# Altium schematic sheet Sheet1.SchDoc (part 1 of 2)
size A0
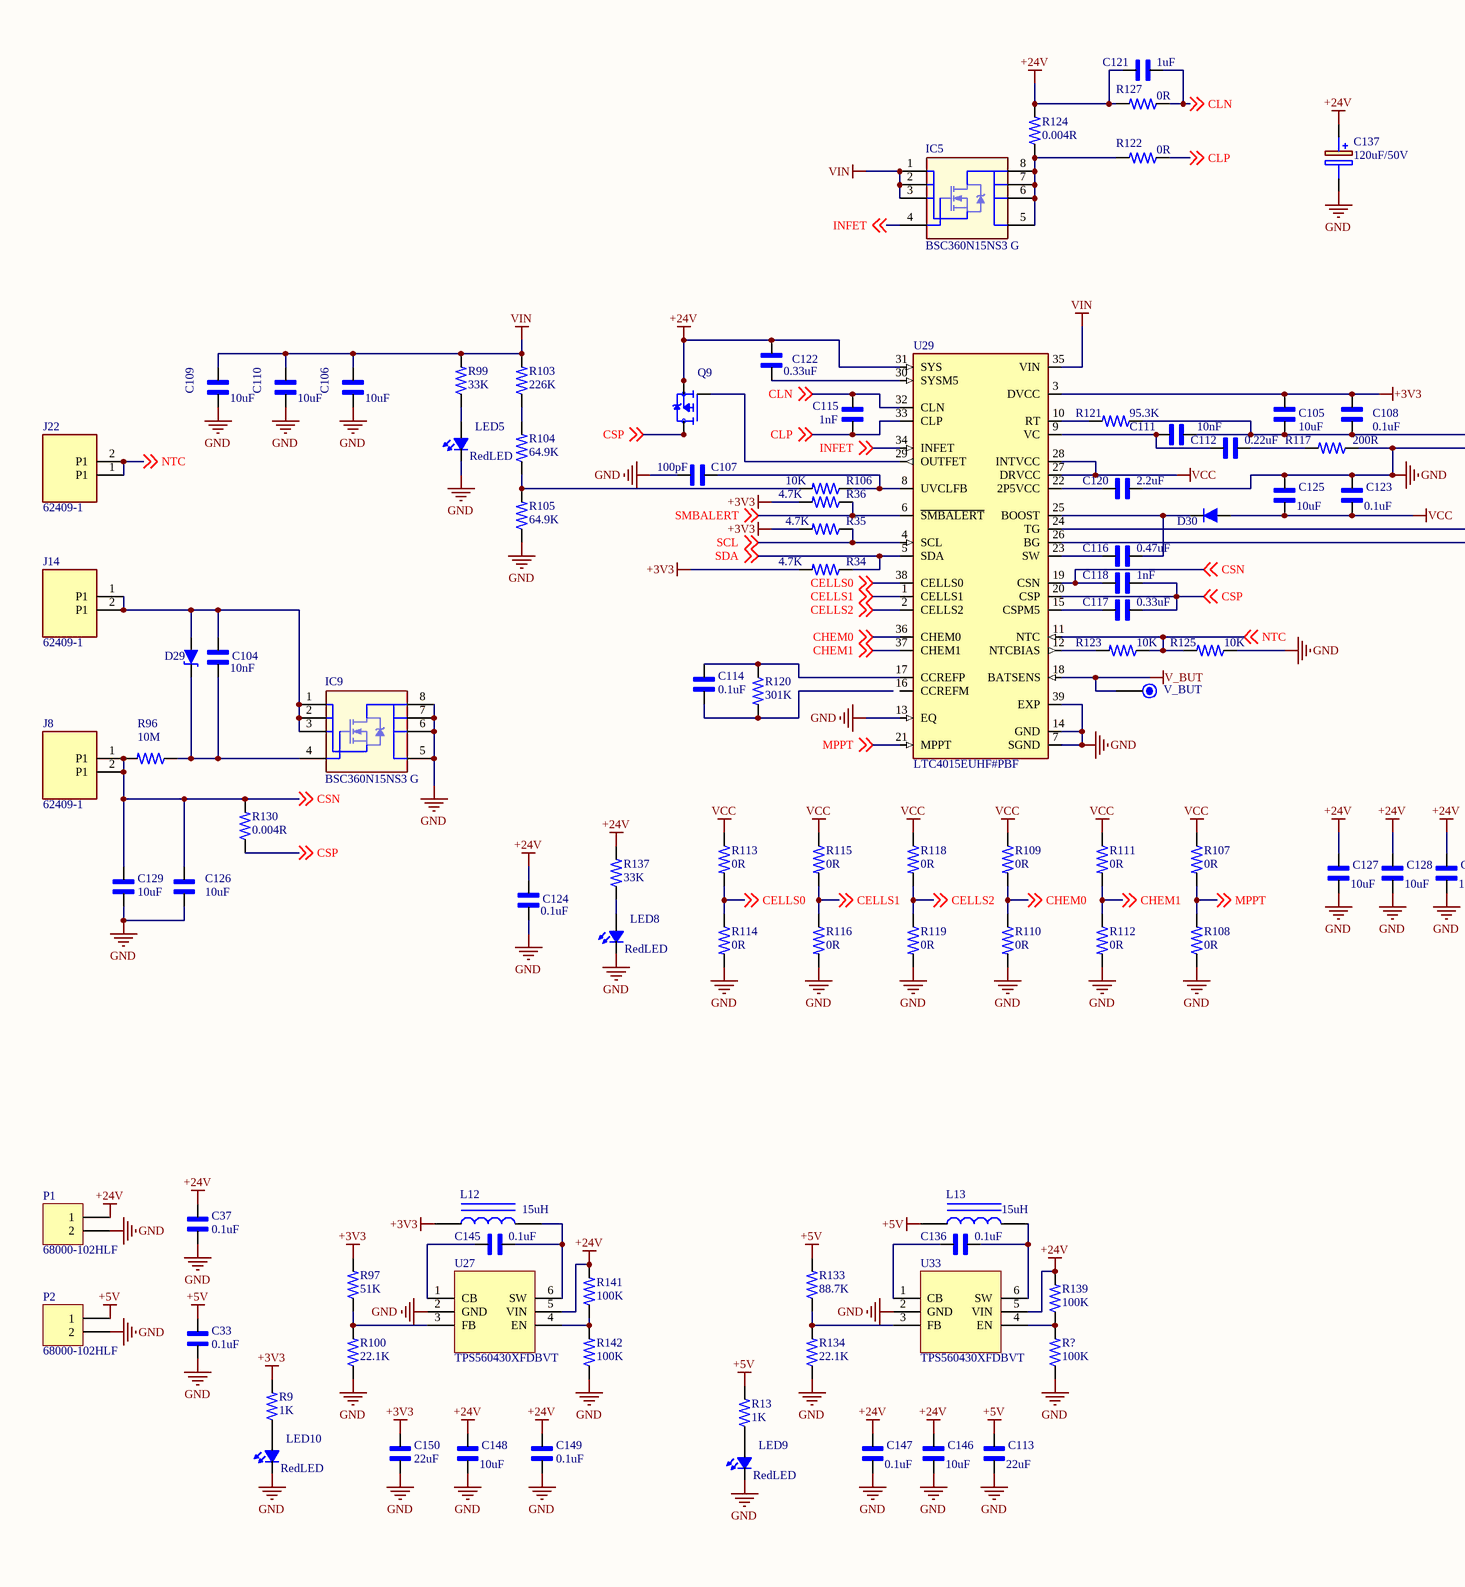
[diagram p0: Sheet1.SchDoc, top left]
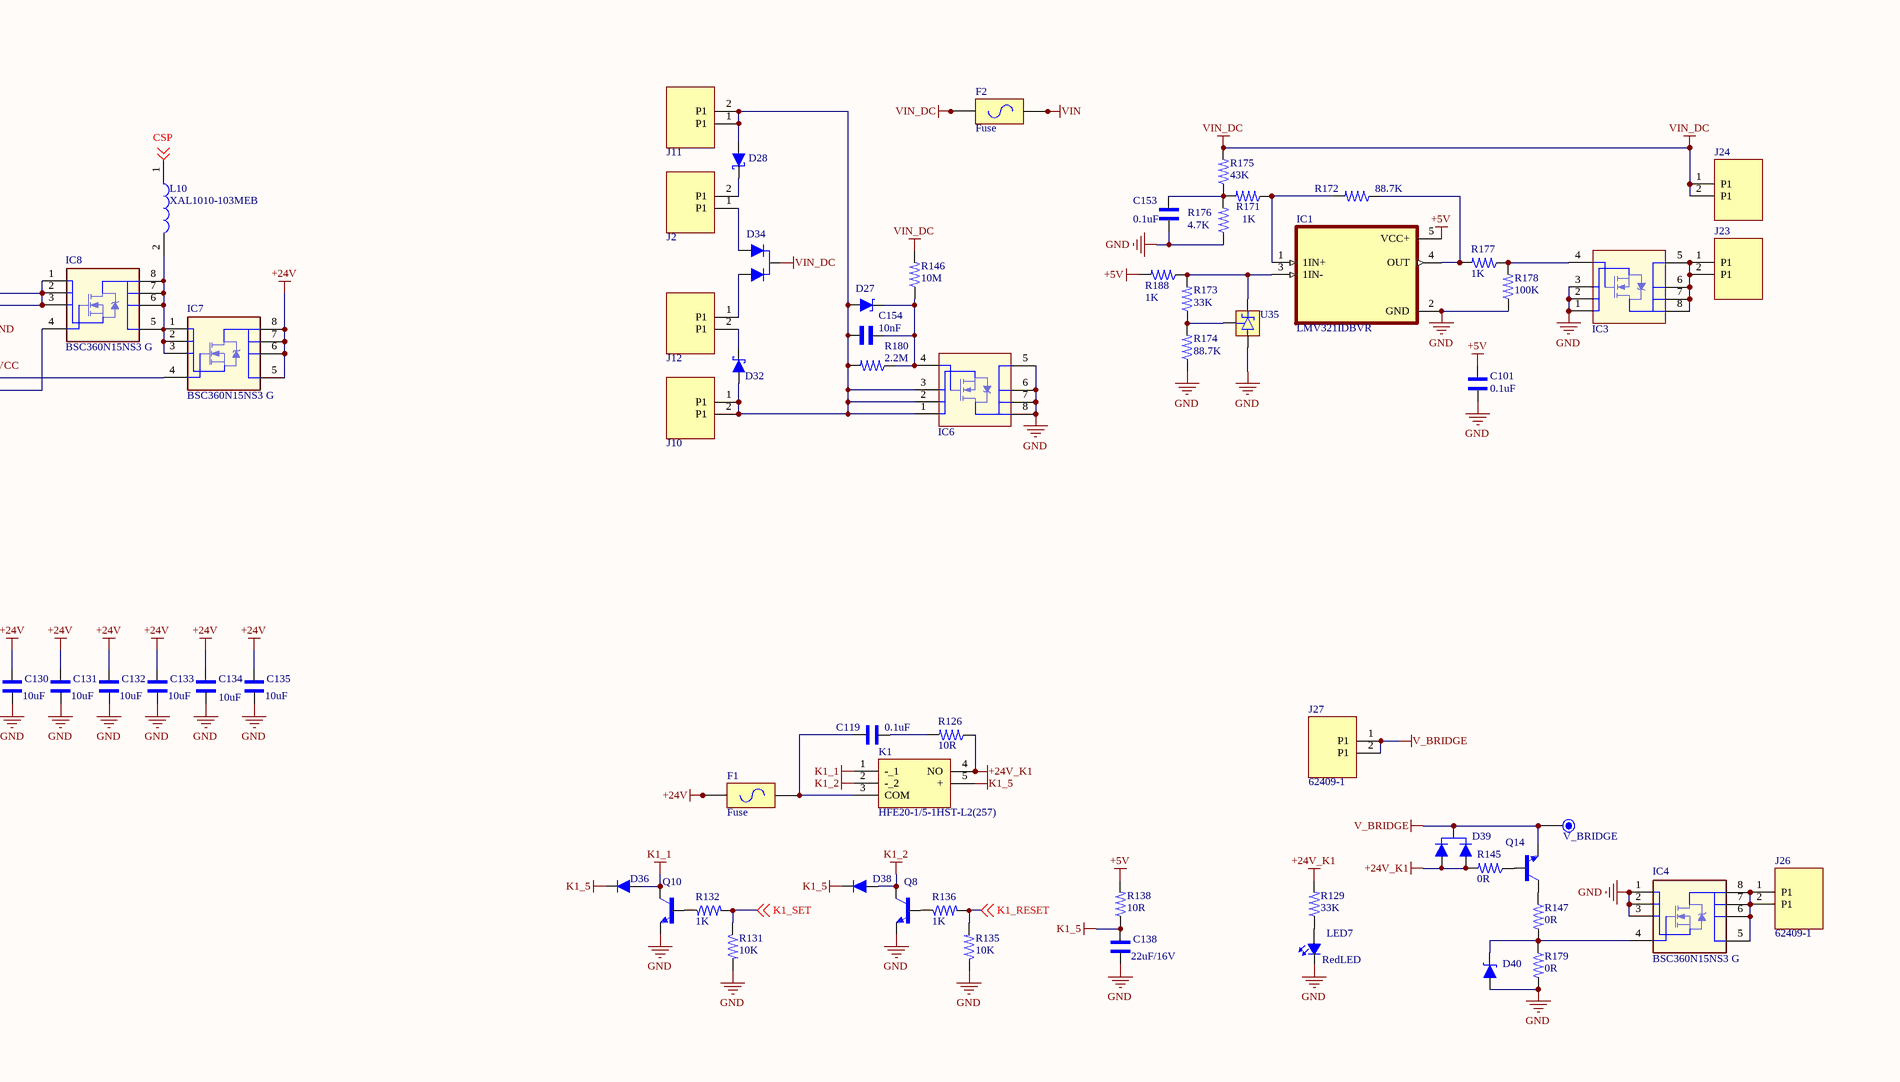
[diagram p1: Sheet1.SchDoc, top middle]
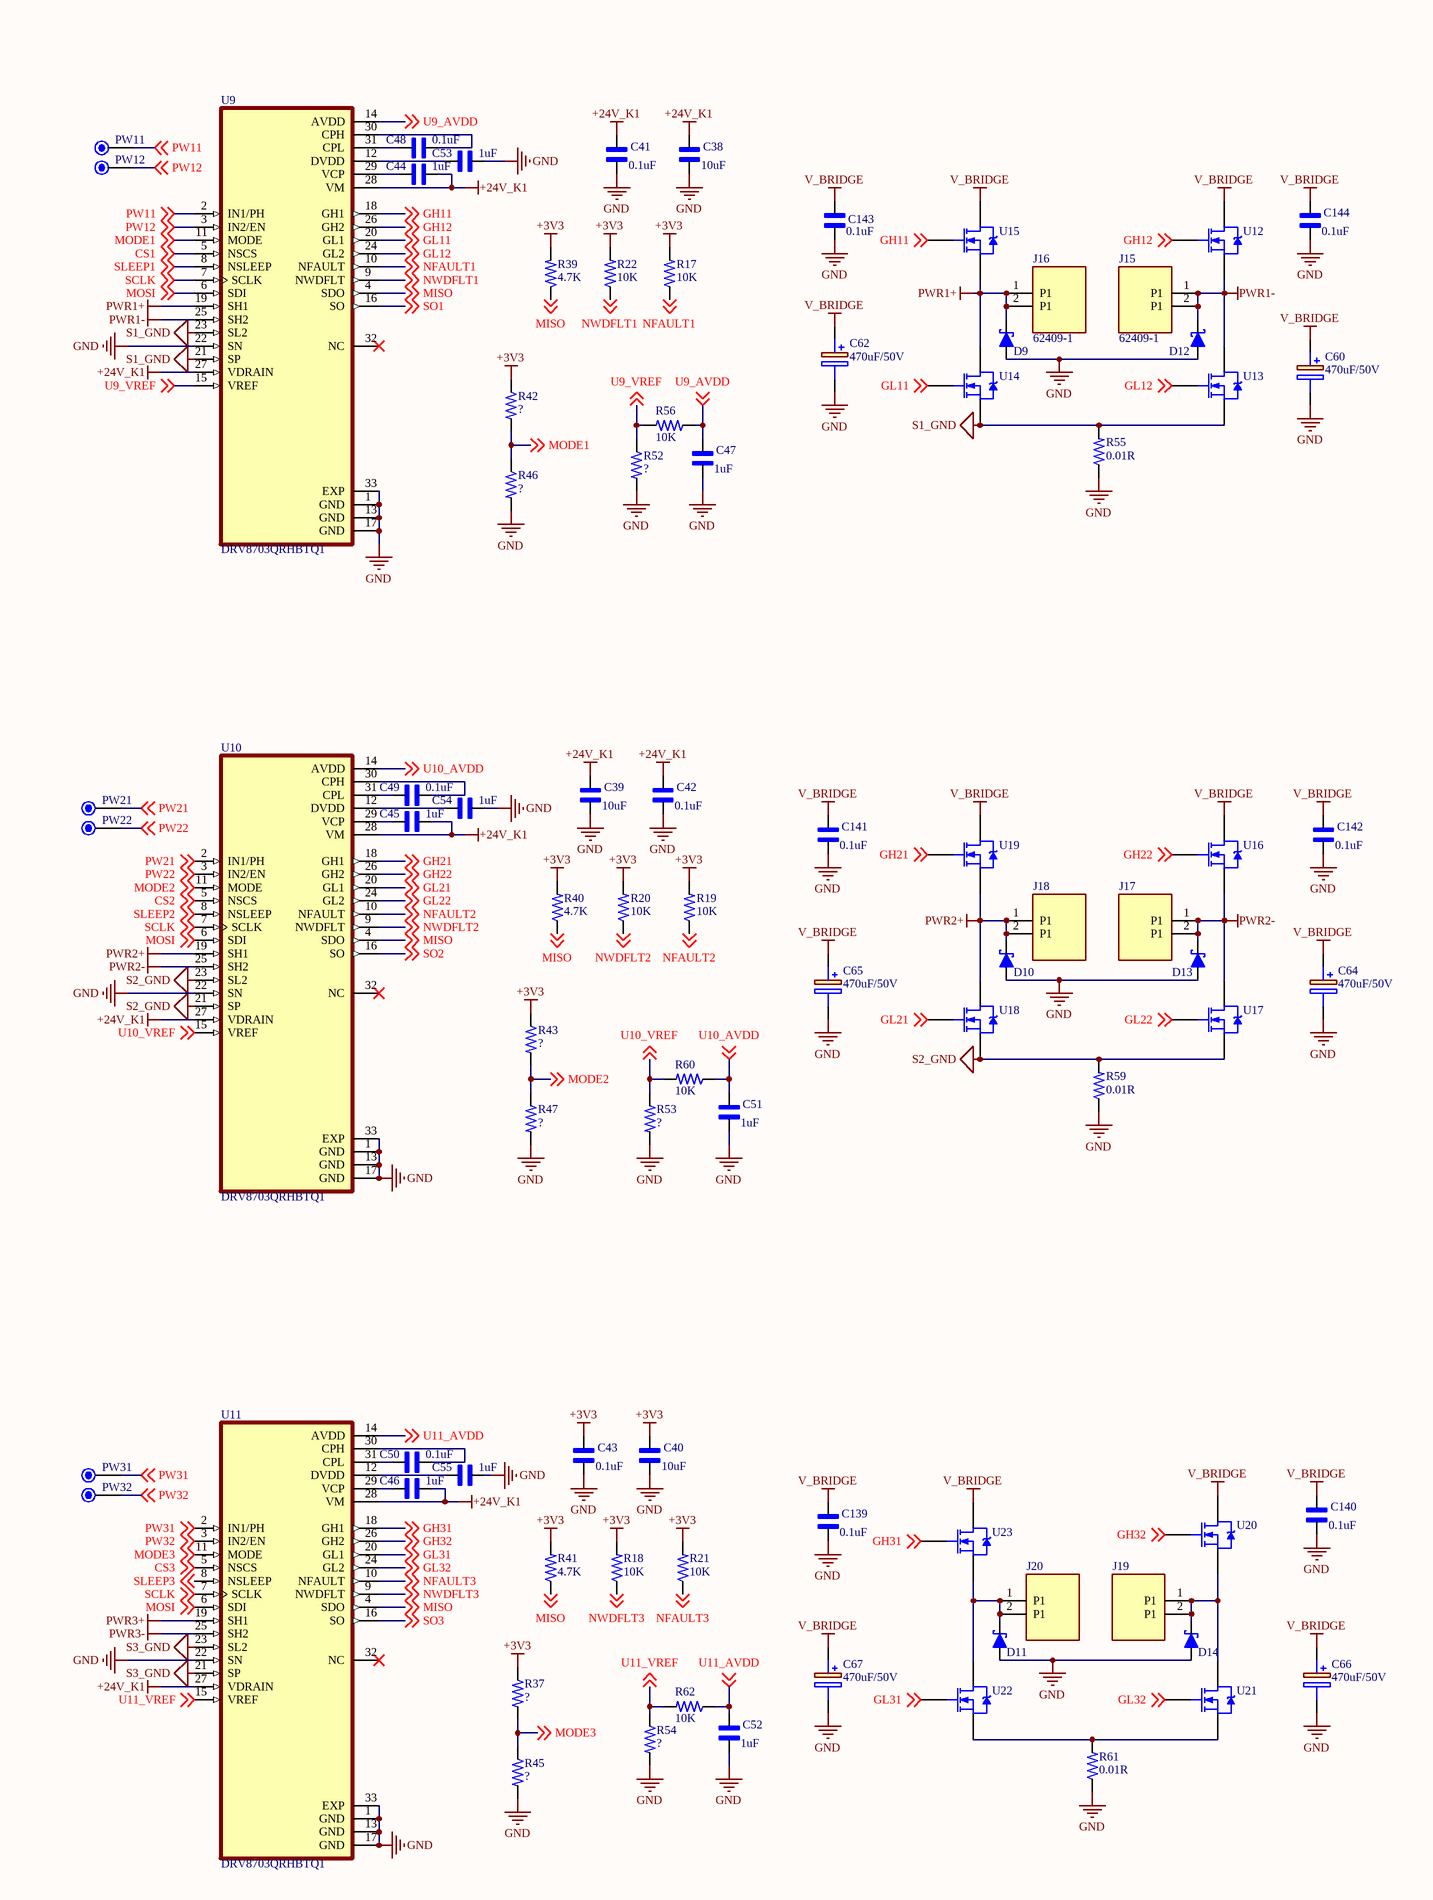
[diagram p2: Sheet1.SchDoc, top right]
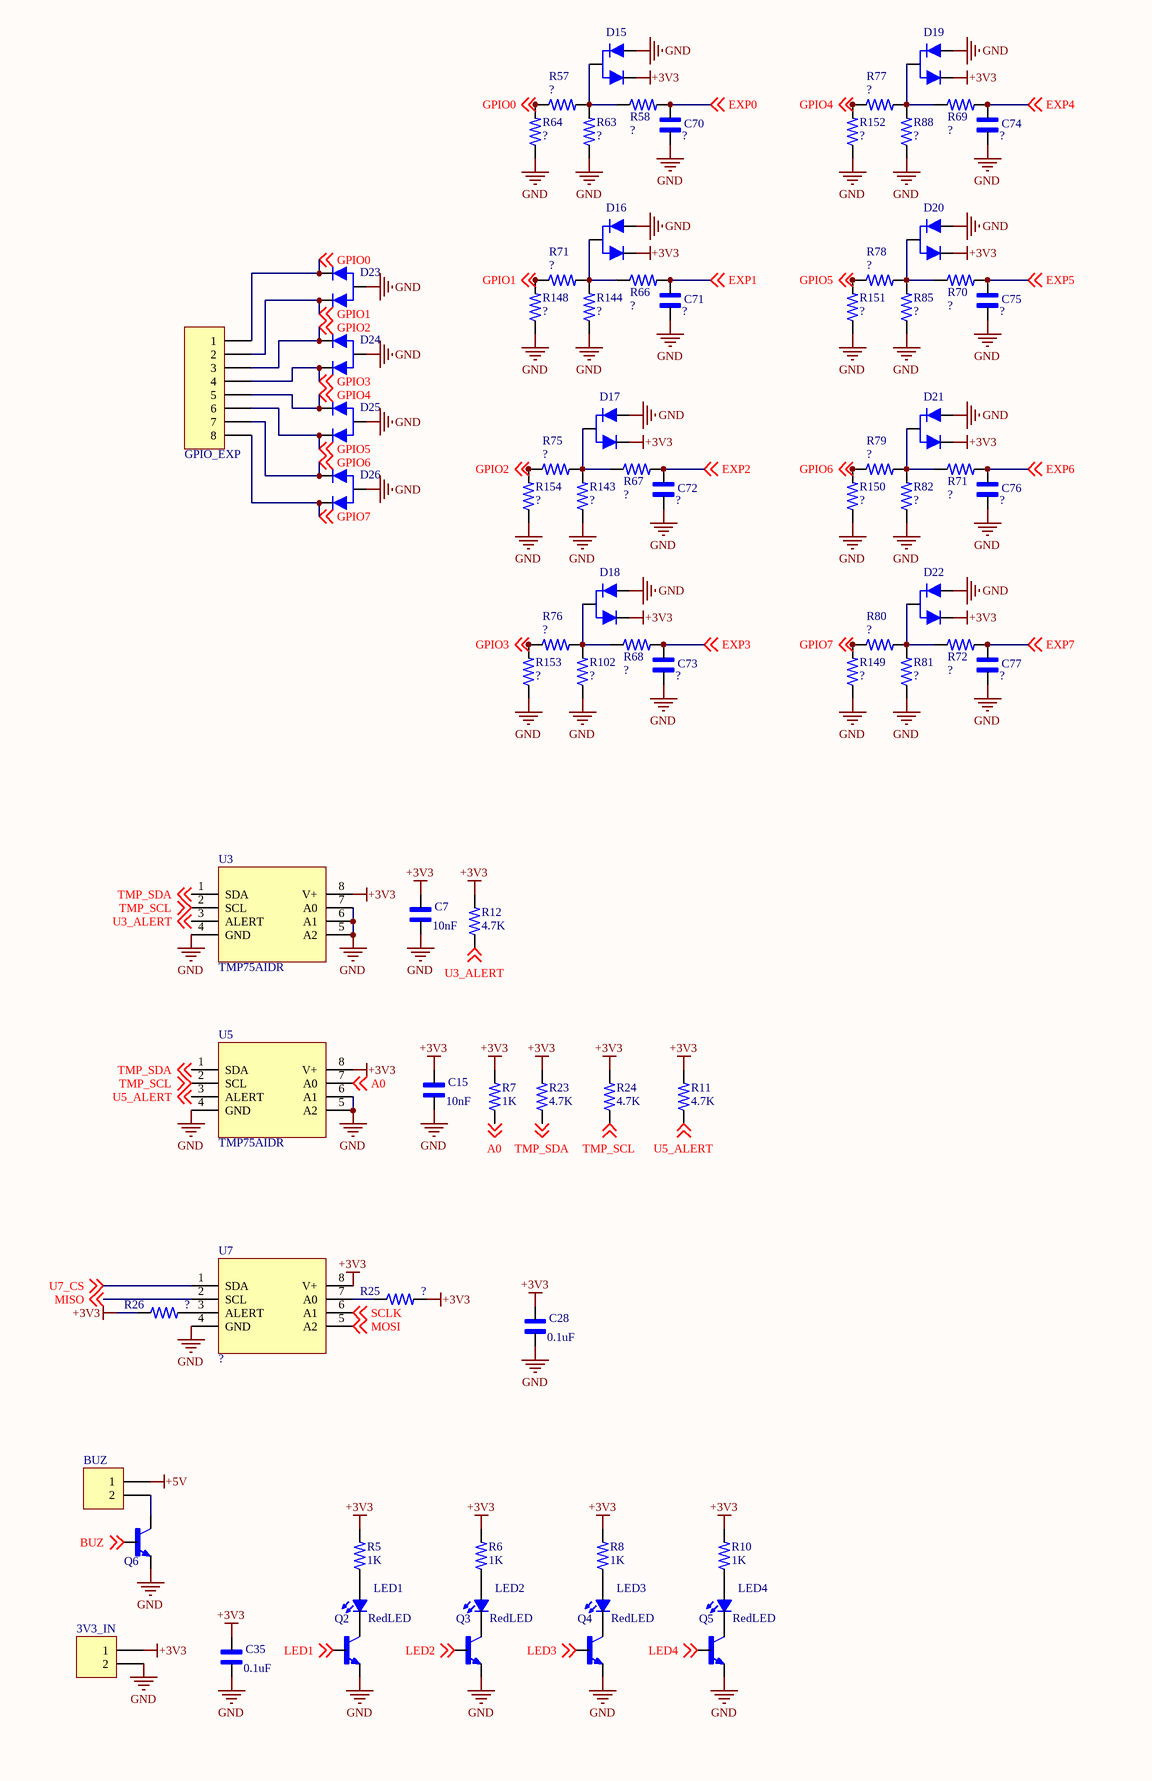
[diagram p3: Sheet1.SchDoc, bottom left]
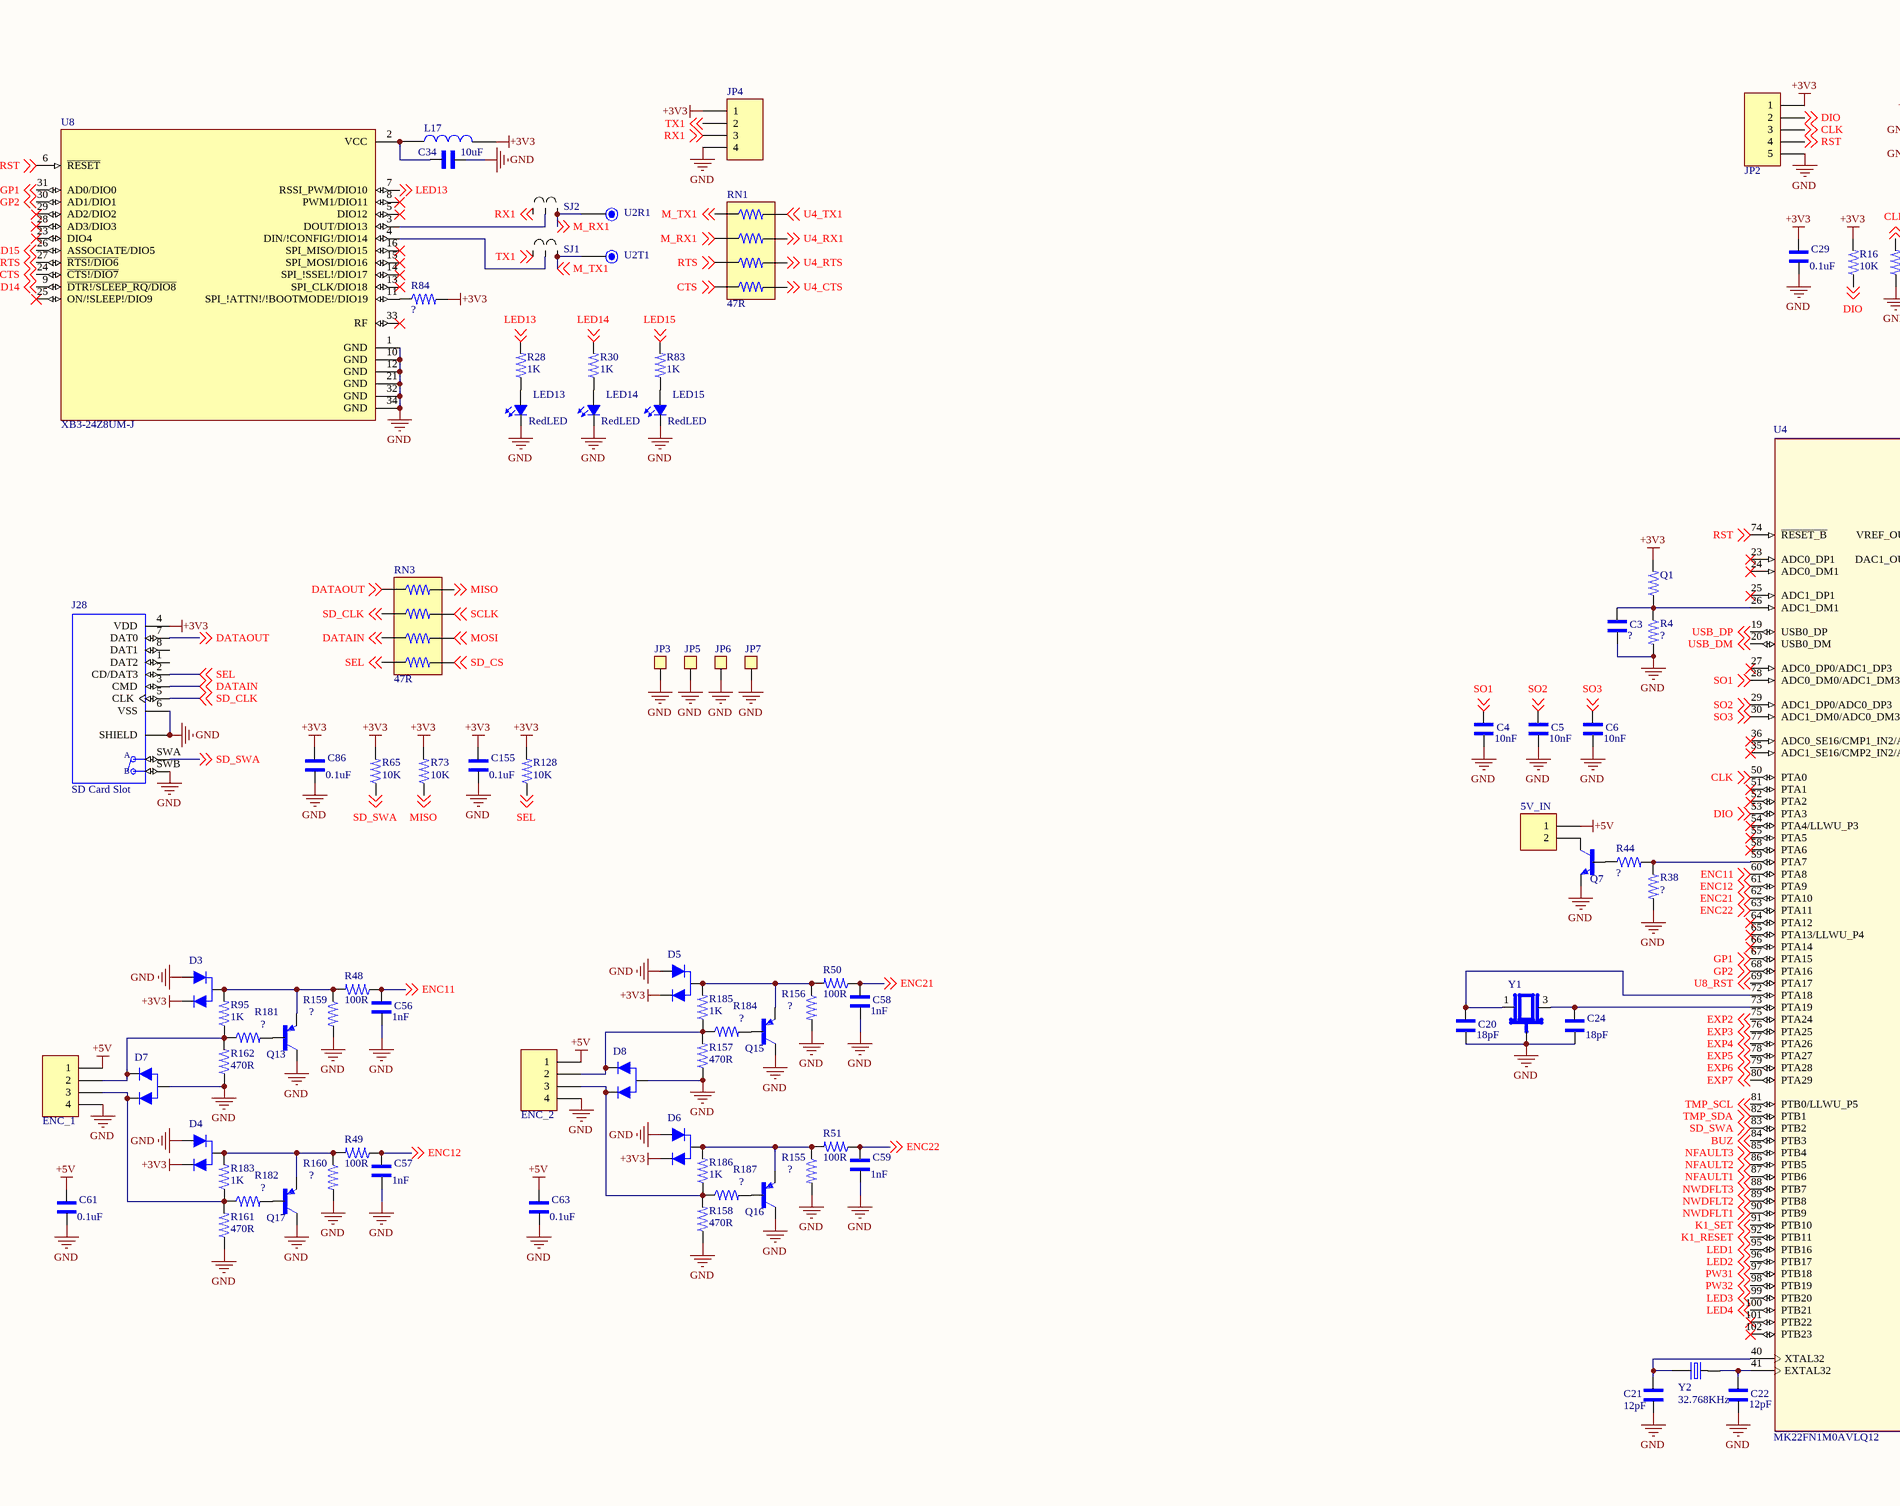
[diagram p4: Sheet1.SchDoc, bottom middle]
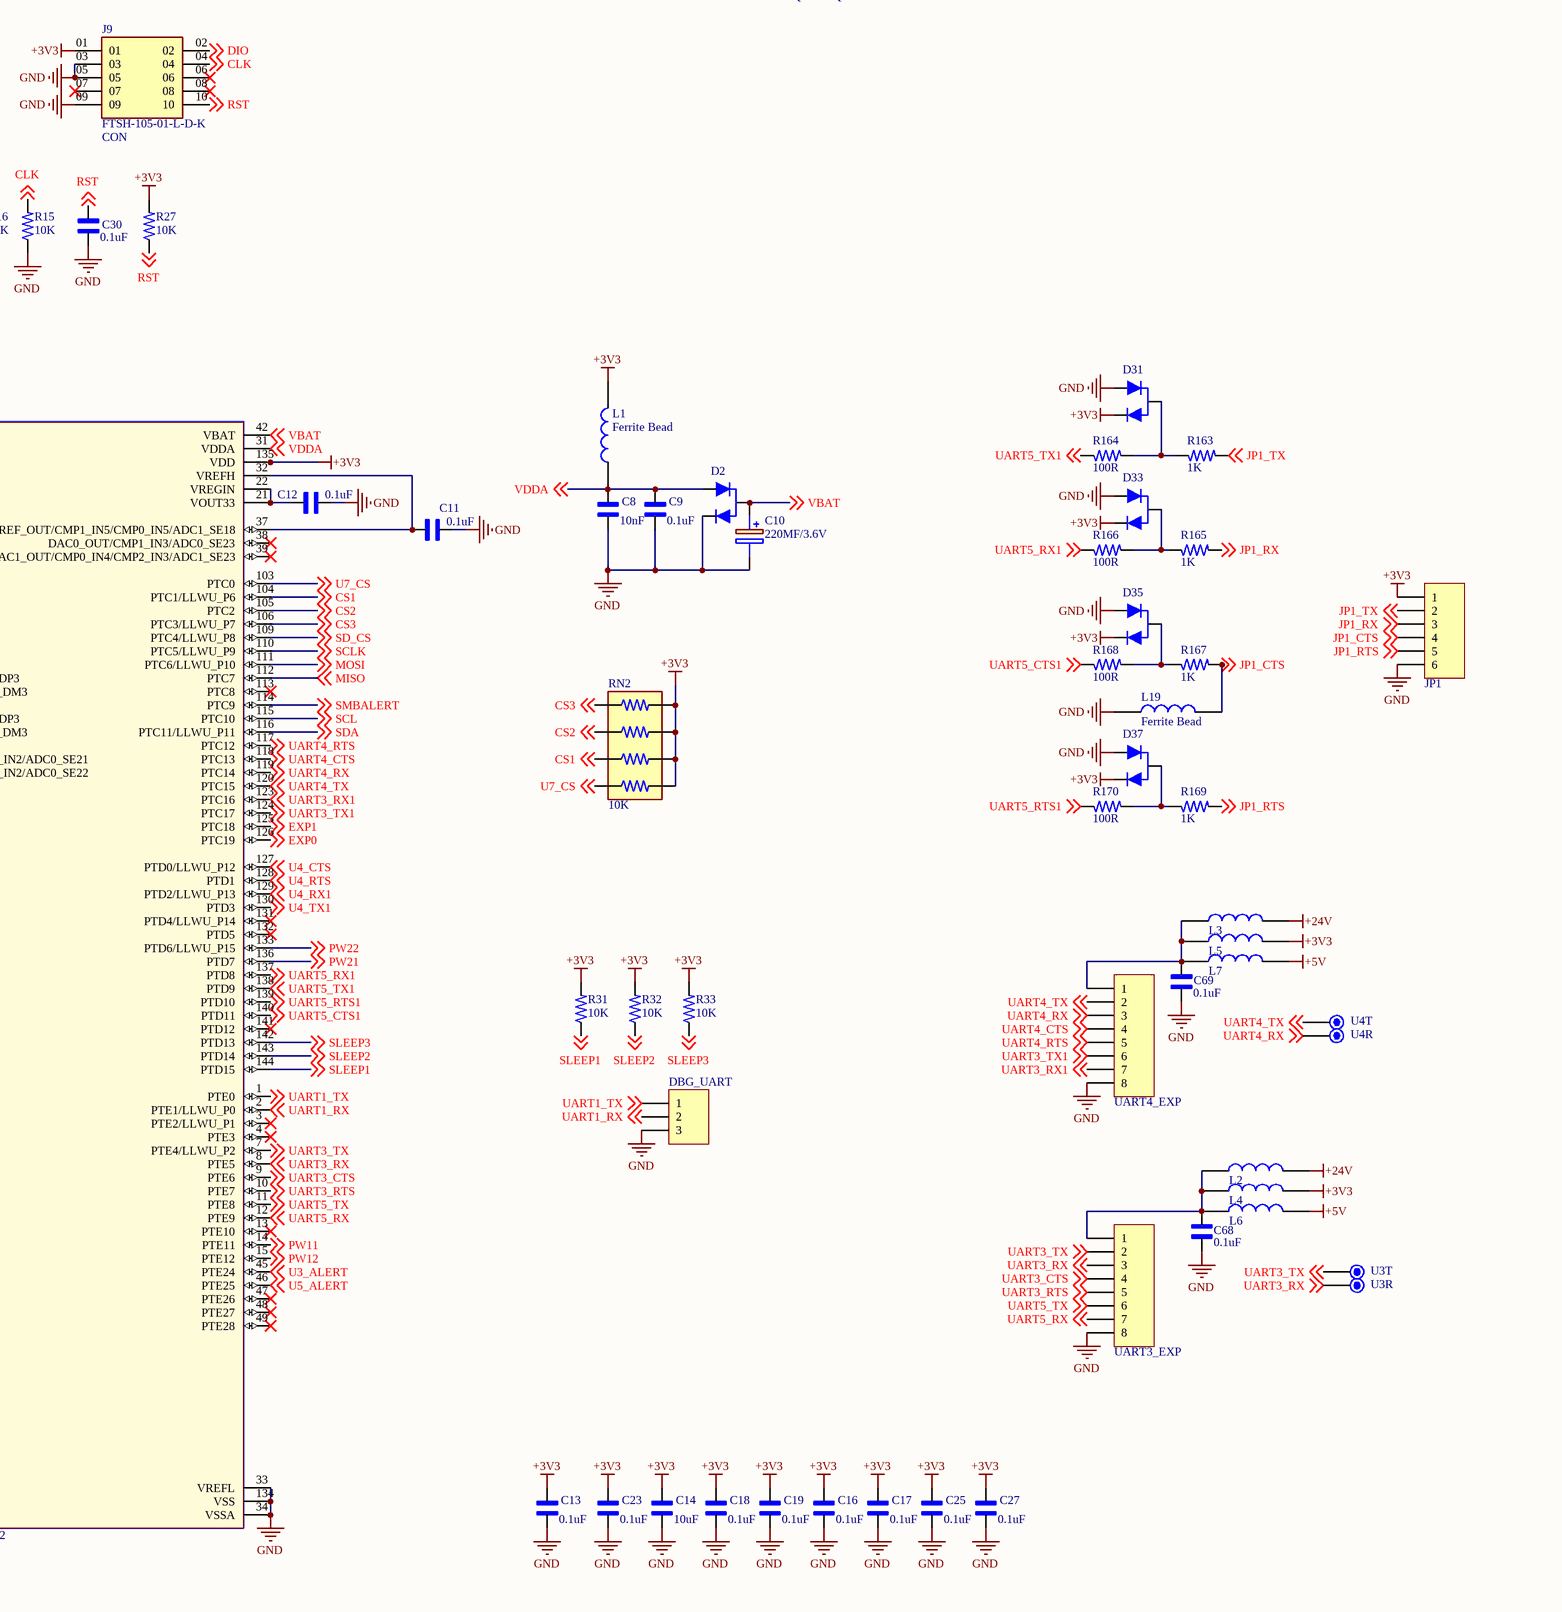
[diagram p5: Sheet1.SchDoc, bottom right]

## Parts
(Parts that share a designator on the sheet are numbered #1, #2 ... from top to bottom, then left to right.)
3V3_IN  68000-102HLF  [HDR1X2(male)]  (value not drawn)
5V_IN  68000-102HLF  [HDR1X2(male)]  (value not drawn)
BUZ  68000-102HLF  [HDR1X2(male)]  (value not drawn)
C3  C?  [CAPC_0805 (2012X140N)]  (value not drawn)
C4  value 10nF  [CAPC_0805 (2012X140N)]  (hidden comment: 08055C103KAT2A)
C5  value 10nF  [CAPC_0805 (2012X140N)]  (hidden comment: 08055C103KAT2A)
C6  value 10nF  [CAPC_0805 (2012X140N)]  (hidden comment: 08055C103KAT2A)
C7  value 10nF  [CAPC_0805 (2012X140N)]  (hidden comment: 08055C103KAT2A)
C8  value 10nF  [CAPC_0805 (2012X140N)]  (hidden comment: 08055C103KAT2A)
C9  value 0.1uF  [CAPC_0805 (2012X140N)]  (hidden comment: 0805B104K500CT)
C10  value 220MF/3.6V  [EEC-RG0V224H]  (hidden comment: EEC-RG0V224H)
C11  value 0.1uF  [CAPC_0805 (2012X140N)]  (hidden comment: 0805B104K500CT)
C12  value 0.1uF  [CAPC_0805 (2012X140N)]  (hidden comment: 0805B104K500CT)
C13  value 0.1uF  [CAPC_0805 (2012X140N)]  (hidden comment: 0805B104K500CT)
C14  value 10uF  [CAPC_0805 (2012X140N)]  (hidden comment: GRM21BR61E106KA73L)
C15  value 10nF  [CAPC_0805 (2012X140N)]  (hidden comment: 08055C103KAT2A)
C16  value 0.1uF  [CAPC_0805 (2012X140N)]  (hidden comment: 0805B104K500CT)
C17  value 0.1uF  [CAPC_0805 (2012X140N)]  (hidden comment: 0805B104K500CT)
C18  value 0.1uF  [CAPC_0805 (2012X140N)]  (hidden comment: 0805B104K500CT)
C19  value 0.1uF  [CAPC_0805 (2012X140N)]  (hidden comment: 0805B104K500CT)
C20  value 18pF  [CAPC_0805 (2012X140N)]  (hidden comment: 0805N180J500CT)
C21  value 12pF  [CAPC_0805 (2012X140N)]  (hidden comment: 0805N120J500CT)
C22  value 12pF  [CAPC_0805 (2012X140N)]  (hidden comment: 0805N120J500CT)
C23  value 0.1uF  [CAPC_0805 (2012X140N)]  (hidden comment: 0805B104K500CT)
C24  value 18pF  [CAPC_0805 (2012X140N)]  (hidden comment: 0805N180J500CT)
C25  value 0.1uF  [CAPC_0805 (2012X140N)]  (hidden comment: 0805B104K500CT)
C27  value 0.1uF  [CAPC_0805 (2012X140N)]  (hidden comment: 0805B104K500CT)
C28  value 0.1uF  [CAPC_0805 (2012X140N)]  (hidden comment: 0805B104K500CT)
C29  value 0.1uF  [CAPC_0805 (2012X140N)]  (hidden comment: 0805B104K500CT)
C30  value 0.1uF  [CAPC_0805 (2012X140N)]  (hidden comment: 0805B104K500CT)
C33  value 0.1uF  [CAPC_0805 (2012X140N)]  (hidden comment: 0805B104K500CT)
C34  value 10uF  [CAPC_0805 (2012X140N)]  (hidden comment: GRM21BR61E106KA73L)
C35  value 0.1uF  [CAPC_0805 (2012X140N)]  (hidden comment: 0805B104K500CT)
C37  value 0.1uF  [CAPC_0805 (2012X140N)]  (hidden comment: 0805B104K500CT)
C38  value 10uF  [CAPC_1210 (3225X280)]  (hidden comment: GRM32ER71H106KA12L)
C39  value 10uF  [CAPC_1210 (3225X280)]  (hidden comment: GRM32ER71H106KA12L)
C40  value 10uF  [CAPC_1210 (3225X280)]  (hidden comment: GRM32ER71H106KA12L)
C41  value 0.1uF  [CAPC_0805 (2012X140N)]  (hidden comment: 0805B104K500CT)
C42  value 0.1uF  [CAPC_0805 (2012X140N)]  (hidden comment: 0805B104K500CT)
C43  value 0.1uF  [CAPC_0805 (2012X140N)]  (hidden comment: 0805B104K500CT)
C44  value 1uF  [CAPC_0805 (2012X140N)]  (hidden comment: 08055C105KAT2A)
C45  value 1uF  [CAPC_0805 (2012X140N)]  (hidden comment: 08055C105KAT2A)
C46  value 1uF  [CAPC_0805 (2012X140N)]  (hidden comment: 08055C105KAT2A)
C47  value 1uF  [CAPC_0805 (2012X140N)]  (hidden comment: 08055C105KAT2A)
C48  value 0.1uF  [CAPC_0805 (2012X140N)]  (hidden comment: 0805B104K500CT)
C49  value 0.1uF  [CAPC_0805 (2012X140N)]  (hidden comment: 0805B104K500CT)
C50  value 0.1uF  [CAPC_0805 (2012X140N)]  (hidden comment: 0805B104K500CT)
C51  value 1uF  [CAPC_0805 (2012X140N)]  (hidden comment: 08055C105KAT2A)
C52  value 1uF  [CAPC_0805 (2012X140N)]  (hidden comment: 08055C105KAT2A)
C53  value 1uF  [CAPC_0805 (2012X140N)]  (hidden comment: 08055C105KAT2A)
C54  value 1uF  [CAPC_0805 (2012X140N)]  (hidden comment: 08055C105KAT2A)
C55  value 1uF  [CAPC_0805 (2012X140N)]  (hidden comment: 08055C105KAT2A)
C56  value 1nF  [CAPC_0805 (2012X140N)]  (hidden comment: 08055C102KAT4A)
C57  value 1nF  [CAPC_0805 (2012X140N)]  (hidden comment: 08055C102KAT4A)
C58  value 1nF  [CAPC_0805 (2012X140N)]  (hidden comment: 08055C102KAT4A)
C59  value 1nF  [CAPC_0805 (2012X140N)]  (hidden comment: 08055C102KAT4A)
C60  value 470uF/50V  [CAPPRD(5x10)]  (hidden comment: ESH477M050AH4AA)
C61  value 0.1uF  [CAPC_0805 (2012X140N)]  (hidden comment: 0805B104K500CT)
C62  value 470uF/50V  [CAPPRD(5x10)]  (hidden comment: ESH477M050AH4AA)
C63  value 0.1uF  [CAPC_0805 (2012X140N)]  (hidden comment: 0805B104K500CT)
C64  value 470uF/50V  [CAPPRD(5x10)]  (hidden comment: ESH477M050AH4AA)
C65  value 470uF/50V  [CAPPRD(5x10)]  (hidden comment: ESH477M050AH4AA)
C66  value 470uF/50V  [CAPPRD(5x10)]  (hidden comment: ESH477M050AH4AA)
C67  value 470uF/50V  [CAPPRD(5x10)]  (hidden comment: ESH477M050AH4AA)
C68  value 0.1uF  [CAPC_0805 (2012X140N)]  (hidden comment: 0805B104K500CT)
C69  value 0.1uF  [CAPC_0805 (2012X140N)]  (hidden comment: 0805B104K500CT)
C70  C?  [CAPC_0805 (2012X140N)]  (value not drawn)
C71  C?  [CAPC_0805 (2012X140N)]  (value not drawn)
C72  C?  [CAPC_0805 (2012X140N)]  (value not drawn)
C73  C?  [CAPC_0805 (2012X140N)]  (value not drawn)
C74  C?  [CAPC_0805 (2012X140N)]  (value not drawn)
C75  C?  [CAPC_0805 (2012X140N)]  (value not drawn)
C76  C?  [CAPC_0805 (2012X140N)]  (value not drawn)
C77  C?  [CAPC_0805 (2012X140N)]  (value not drawn)
C86  value 0.1uF  [CAPC_0805 (2012X140N)]  (hidden comment: 0805B104K500CT)
C101  value 0.1uF  [CAPC_0805 (2012X140N)]  (hidden comment: 0805B104K500CT)
C104  value 10nF  [CAPC_0805 (2012X140N)]  (hidden comment: 08055C103KAT2A)
C105  value 10uF  [CAPC_0805 (2012X140N)]  (hidden comment: GRM21BR61E106KA73L)
C106  value 10uF  [CAPC_1210 (3225X280)]  (hidden comment: GRM32ER71H106KA12L)
C107  value 100pF  [CAPC_0805 (2012X140N)]  (hidden comment: VJ0805A101JXAAC)
C108  value 0.1uF  [CAPC_0805 (2012X140N)]  (hidden comment: 0805B104K500CT)
C109  value 10uF  [CAPC_1210 (3225X280)]  (hidden comment: GRM32ER71H106KA12L)
C110  value 10uF  [CAPC_1210 (3225X280)]  (hidden comment: GRM32ER71H106KA12L)
C111  value 10nF  [CAPC_0805 (2012X140N)]  (hidden comment: 08055C103KAT2A)
C112  value 0.22uF  [CAPC_0805 (2012X140N)]  (hidden comment: UMK212B7224KG-T)
C113  value 22uF  [CAPC_0805 (2012X140N)]  (hidden comment: GRM21BR60J226ME39L)
C114  value 0.1uF  [CAPC_0805 (2012X140N)]  (hidden comment: 0805B104K500CT)
C115  value 1nF  [CAPC_0805 (2012X140N)]  (hidden comment: 08055C102KAT4A)
C116  value 0.47uF  [CAPC_0805 (2012X140N)]  (hidden comment: CC0805ZRY5V9BB474)
C117  value 0.33uF  [CAPC_0805 (2012X140N)]  (hidden comment: VJ0805V334MXACW1BC)
C118  value 1nF  [CAPC_0805 (2012X140N)]  (hidden comment: 08055C102KAT4A)
C119  value 0.1uF  [CAP_1206 (C3216X88N)]  (hidden comment: C1206C104M5RACTU)
C120  value 2.2uF  [CAPC_0805 (2012X140N)]  (hidden comment: UMK212BB7225KG-T)
C121  value 1uF  [CAPC_0805 (2012X140N)]  (hidden comment: 08055C105KAT2A)
C122  value 0.33uF  [CAPC_0805 (2012X140N)]  (hidden comment: VJ0805V334MXACW1BC)
C123  value 0.1uF  [CAPC_0805 (2012X140N)]  (hidden comment: 0805B104K500CT)
C124  value 0.1uF  [CAPC_0805 (2012X140N)]  (hidden comment: 0805B104K500CT)
C125  value 10uF  [CAPC_0805 (2012X140N)]  (hidden comment: GRM21BR61E106KA73L)
C126  value 10uF  [CAPC_1210 (3225X280)]  (hidden comment: GRM32ER71H106KA12L)
C127  value 10uF  [CAPC_1210 (3225X280)]  (hidden comment: GRM32ER71H106KA12L)
C128  value 10uF  [CAPC_1210 (3225X280)]  (hidden comment: GRM32ER71H106KA12L)
C129  value 10uF  [CAPC_1210 (3225X280)]  (hidden comment: GRM32ER71H106KA12L)
C130  value 10uF  [CAPC_1210 (3225X280)]  (hidden comment: GRM32ER71H106KA12L)
C131  value 10uF  [CAPC_1210 (3225X280)]  (hidden comment: GRM32ER71H106KA12L)
C132  value 10uF  [CAPC_1210 (3225X280)]  (hidden comment: GRM32ER71H106KA12L)
C133  value 10uF  [CAPC_1210 (3225X280)]  (hidden comment: GRM32ER71H106KA12L)
C134  value 10uF  [CAPC_1210 (3225X280)]  (hidden comment: GRM32ER71H106KA12L)
C135  value 10uF  [CAPC_1210 (3225X280)]  (hidden comment: GRM32ER71H106KA12L)
C136  value 0.1uF  [CAPC_0805 (2012X140N)]  (hidden comment: 0805B104K500CT)
C137  value 120uF/50V  [CAPPRD(5x10)]  (hidden comment: 860020675017)
C138  value 22uF/16V  [CAP_1206 (C3216X88N)]  (hidden comment: 1206X226K160CT)
C139  value 0.1uF  [CAPC_0805 (2012X140N)]  (hidden comment: 0805B104K500CT)
C140  value 0.1uF  [CAPC_0805 (2012X140N)]  (hidden comment: 0805B104K500CT)
C141  value 0.1uF  [CAPC_0805 (2012X140N)]  (hidden comment: 0805B104K500CT)
C142  value 0.1uF  [CAPC_0805 (2012X140N)]  (hidden comment: 0805B104K500CT)
C143  value 0.1uF  [CAPC_0805 (2012X140N)]  (hidden comment: 0805B104K500CT)
C144  value 0.1uF  [CAPC_0805 (2012X140N)]  (hidden comment: 0805B104K500CT)
C145  value 0.1uF  [CAPC_0805 (2012X140N)]  (hidden comment: 0805B104K500CT)
C146  value 10uF  [CAPC_1210 (3225X280)]  (hidden comment: GRM32ER71H106KA12L)
C147  value 0.1uF  [CAPC_0805 (2012X140N)]  (hidden comment: 0805B104K500CT)
C148  value 10uF  [CAPC_1210 (3225X280)]  (hidden comment: GRM32ER71H106KA12L)
C149  value 0.1uF  [CAPC_0805 (2012X140N)]  (hidden comment: 0805B104K500CT)
C150  value 22uF  [CAPC_0805 (2012X140N)]  (hidden comment: GRM21BR60J226ME39L)
C153  value 0.1uF  [CAPC_0805 (2012X140N)]  (hidden comment: 0805B104K500CT)
C154  value 10nF  [CAPC_0805 (2012X140N)]  (hidden comment: 08055C103KAT2A)
C155  value 0.1uF  [CAPC_0805 (2012X140N)]  (hidden comment: 0805B104K500CT)
D2  BAS40-04E6327  [SOT-23-3(TO-236)]  (value not drawn)
D3  BAT54S,215  [SOT-23-3(TO-236)]  (value not drawn)
D4  BAT54S,215  [SOT-23-3(TO-236)]  (value not drawn)
D5  BAT54S,215  [SOT-23-3(TO-236)]  (value not drawn)
D6  BAT54S,215  [SOT-23-3(TO-236)]  (value not drawn)
D7  BAS40-06  [SOT-23-3(TO-236)]  (value not drawn)
D8  BAS40-06  [SOT-23-3(TO-236)]  (value not drawn)
D9  SMLJ43CA  [DO-214]  (value not drawn)
D10  SMLJ43CA  [DO-214]  (value not drawn)
D11  SMLJ43CA  [DO-214]  (value not drawn)
D12  SMLJ43CA  [DO-214]  (value not drawn)
D13  SMLJ43CA  [DO-214]  (value not drawn)
D14  SMLJ43CA  [DO-214]  (value not drawn)
D15  BAT54S,215  [SOT-23-3(TO-236)]  (value not drawn)
D16  BAT54S,215  [SOT-23-3(TO-236)]  (value not drawn)
D17  BAT54S,215  [SOT-23-3(TO-236)]  (value not drawn)
D18  BAT54S,215  [SOT-23-3(TO-236)]  (value not drawn)
D19  BAT54S,215  [SOT-23-3(TO-236)]  (value not drawn)
D20  BAT54S,215  [SOT-23-3(TO-236)]  (value not drawn)
D21  BAT54S,215  [SOT-23-3(TO-236)]  (value not drawn)
D22  BAT54S,215  [SOT-23-3(TO-236)]  (value not drawn)
D23  BAS40-06  [SOT-23-3(TO-236)]  (value not drawn)
D24  BAS40-06  [SOT-23-3(TO-236)]  (value not drawn)
D25  BAS40-06  [SOT-23-3(TO-236)]  (value not drawn)
D26  BAS40-06  [SOT-23-3(TO-236)]  (value not drawn)
D27  BZX384-B15,115  [SOD323 (SOD2513X114N)]  (value not drawn)
D28  SMAJ43A-E3/61  [DO-214]  (value not drawn)
D29  BZX384-B15,115  [SOD323 (SOD2513X114N)]  (value not drawn)
D30  1N4148WS-7-F  [SOD323 (SOD2513X114N)]  (value not drawn)
D31  BAT54S,215  [SOT-23-3(TO-236)]  (value not drawn)
D32  SMAJ43A-E3/61  [DO-214]  (value not drawn)
D33  BAT54S,215  [SOT-23-3(TO-236)]  (value not drawn)
D34  MBRD20100CT-13  [TO-252AA(DPAK229P990X238-3N)]  (value not drawn)
D35  BAT54S,215  [SOT-23-3(TO-236)]  (value not drawn)
D36  1N4148WS-7-F  [SOD323 (SOD2513X114N)]  (value not drawn)
D37  BAT54S,215  [SOT-23-3(TO-236)]  (value not drawn)
D38  1N4148WS-7-F  [SOD323 (SOD2513X114N)]  (value not drawn)
D39  MBRD20100CT-13  [TO-252AA(DPAK229P990X238-3N)]  (value not drawn)
D40  BZX384-B15,115  [SOD323 (SOD2513X114N)]  (value not drawn)
DBG_UART  68000-103HLF  [HDR1X3 (male)]  (value not drawn)
ENC_1  68000-104HLF  [HDR1X4(male)]  (value not drawn)
ENC_2  68000-104HLF  [HDR1X4(male)]  (value not drawn)
F1  value Fuse  [FUSE Holder]  (hidden comment: C3130)
F2  value Fuse  [FUSE Holder]  (hidden comment: C3130)
GPIO_EXP  68001-108HLF  [HDR1X8 (male)]  (value not drawn)
IC1  LMV321IDBVR  [SOT23-5 (95P284X120-5N)]
IC3  BSC360N15NS3 G  [TRANS_BSC022N04LS6ATMA1]  (value not drawn)
IC4  BSC360N15NS3 G  [TRANS_BSC022N04LS6ATMA1]
IC5  BSC360N15NS3 G  [TRANS_BSC022N04LS6ATMA1]
IC6  BSC360N15NS3 G  [TRANS_BSC022N04LS6ATMA1]  (value not drawn)
IC7  BSC360N15NS3 G  [TRANS_BSC022N04LS6ATMA1]
IC8  BSC360N15NS3 G  [TRANS_BSC022N04LS6ATMA1]
IC9  BSC360N15NS3 G  [TRANS_BSC022N04LS6ATMA1]
J2  62409-1  [TE_62409-1]  (value not drawn)
J8  62409-1  [TE_62409-1]
J9  FTSH-105-01-L-D-K  value CON  [FTSH-105-01-L-D-K]
J10  62409-1  [TE_62409-1]  (value not drawn)
J11  62409-1  [TE_62409-1]  (value not drawn)
J12  62409-1  [TE_62409-1]  (value not drawn)
J14  62409-1  [TE_62409-1]
J15  62409-1  [TE_62409-1]
J16  62409-1  [TE_62409-1]
J17  62409-1  [TE_62409-1]  (value not drawn)
J18  62409-1  [TE_62409-1]  (value not drawn)
J19  62409-1  [TE_62409-1]  (value not drawn)
J20  62409-1  [TE_62409-1]  (value not drawn)
J22  62409-1  [TE_62409-1]
J23  62409-1  [TE_62409-1]  (value not drawn)
J24  62409-1  [TE_62409-1]  (value not drawn)
J26  62409-1  [TE_62409-1]
J27  62409-1  [TE_62409-1]
J28  value SD Card Slot  [HRS_DM3AT-SF-PEJM5]  (hidden comment: DM3AT-SF-PEJM5)
JP1  68000-106HLF  [HDR1X6(male)]  (value not drawn)
JP2  68000-105HLF  [HDR1X5(male)]  (value not drawn)
JP3  PH1-01-UA  [HDR1(male)]  (value not drawn)
JP4  68000-104HLF  [HDR1X4(male)]  (value not drawn)
JP5  PH1-01-UA  [HDR1(male)]  (value not drawn)
JP6  PH1-01-UA  [HDR1(male)]  (value not drawn)
JP7  PH1-01-UA  [HDR1(male)]  (value not drawn)
K1  HFE20-1/5-1HST-L2(257)  [HFE20151HSTL2257]
L1  value Ferrite Bead  [RESC_0805 (2012X50N)]  (hidden comment: BK2125HS601-T)
L2  BK2125HS601-T  [RESC_0805 (2012X50N)]  (value not drawn)
L3  BK2125HS601-T  [RESC_0805 (2012X50N)]  (value not drawn)
L4  BK2125HS601-T  [RESC_0805 (2012X50N)]  (value not drawn)
L5  BK2125HS601-T  [RESC_0805 (2012X50N)]  (value not drawn)
L6  BK2125HS601-T  [RESC_0805 (2012X50N)]  (value not drawn)
L7  BK2125HS601-T  [RESC_0805 (2012X50N)]  (value not drawn)
L10  XAL1010-103MEB  [XAL1010103MEB]
L12  value 15uH  [INDPM6965X300N]  (hidden comment: SRN6045-150M)
L13  value 15uH  [INDPM6965X300N]  (hidden comment: SRN6045-150M)
L17  BK2125HS601-T  [RESC_0805 (2012X50N)]  (value not drawn)
L19  value Ferrite Bead  [RESC_0805 (2012X50N)]  (hidden comment: BK2125HS601-T)
LED1  value RedLED  [LED_0805_R]  (hidden comment: EL-17-21SURC/S530-A2/TR8)
LED2  value RedLED  [LED_0805_R]  (hidden comment: EL-17-21SURC/S530-A2/TR8)
LED3  value RedLED  [LED_0805_R]  (hidden comment: EL-17-21SURC/S530-A2/TR8)
LED4  value RedLED  [LED_0805_R]  (hidden comment: EL-17-21SURC/S530-A2/TR8)
LED5  value RedLED  [LED_0805_R]  (hidden comment: EL-17-21SURC/S530-A2/TR8)
LED7  value RedLED  [LED_0805_R]  (hidden comment: EL-17-21SURC/S530-A2/TR8)
LED8  value RedLED  [LED_0805_R]  (hidden comment: EL-17-21SURC/S530-A2/TR8)
LED9  value RedLED  [LED_0805_R]  (hidden comment: EL-17-21SURC/S530-A2/TR8)
LED10  value RedLED  [LED_0805_R]  (hidden comment: EL-17-21SURC/S530-A2/TR8)
LED13  value RedLED  [LED_0805_R]  (hidden comment: EL-17-21SURC/S530-A2/TR8)
LED14  value RedLED  [LED_0805_R]  (hidden comment: EL-17-21SURC/S530-A2/TR8)
LED15  value RedLED  [LED_0805_R]  (hidden comment: EL-17-21SURC/S530-A2/TR8)
P1  68000-102HLF  [HDR1X2(male)]
P2  68000-102HLF  [HDR1X2(male)]
PW11  E_PAD  [E_PAD (SMD)]  (value not drawn)
PW12  E_PAD  [E_PAD (SMD)]  (value not drawn)
PW21  E_PAD  [E_PAD (SMD)]  (value not drawn)
PW22  E_PAD  [E_PAD (SMD)]  (value not drawn)
PW31  E_PAD  [E_PAD (SMD)]  (value not drawn)
PW32  E_PAD  [E_PAD (SMD)]  (value not drawn)
Q1  Q?  [RES (0603)]  (value not drawn)
Q2  PDTC114ET,215  [SOT-23-3(TO-236)]  (value not drawn)
Q3  PDTC114ET,215  [SOT-23-3(TO-236)]  (value not drawn)
Q4  PDTC114ET,215  [SOT-23-3(TO-236)]  (value not drawn)
Q5  PDTC114ET,215  [SOT-23-3(TO-236)]  (value not drawn)
Q6  PDTC114ET,215  [SOT-23-3(TO-236)]  (value not drawn)
Q7  PDTC114ET,215  [SOT-23-3(TO-236)]  (value not drawn)
Q8  BC847B-7-F  [SOT-23-3(TO-236)]  (value not drawn)
Q9  SI7611DN-T1-GE3  [SIS468DN-T1-GE3]  (value not drawn)
Q10  BC847B-7-F  [SOT-23-3(TO-236)]  (value not drawn)
Q13  PNP TRANS  [SOT-23-3(TO-236)]  (value not drawn)
Q14  BC847B-7-F  [SOT-23-3(TO-236)]  (value not drawn)
Q15  PNP TRANS  [SOT-23-3(TO-236)]  (value not drawn)
Q16  PNP TRANS  [SOT-23-3(TO-236)]  (value not drawn)
Q17  PNP TRANS  [SOT-23-3(TO-236)]  (value not drawn)
R4  R?  [RESC_0805 (2012X50N)]  (value not drawn)
R5  value 1K  [RESC_0805 (2012X50N)]  (hidden comment: RC0805FR-071KL)
R6  value 1K  [RESC_0805 (2012X50N)]  (hidden comment: RC0805FR-071KL)
R7  value 1K  [RESC_0805 (2012X50N)]  (hidden comment: RC0805FR-071KL)
R8  value 1K  [RESC_0805 (2012X50N)]  (hidden comment: RC0805FR-071KL)
R9  value 1K  [RESC_0805 (2012X50N)]  (hidden comment: RC0805FR-071KL)
R10  value 1K  [RESC_0805 (2012X50N)]  (hidden comment: RC0805FR-071KL)
R11  value 4.7K  [RESC_0805 (2012X50N)]  (hidden comment: CRCW08054K70FKEA)
R12  value 4.7K  [RESC_0805 (2012X50N)]  (hidden comment: CRCW08054K70FKEA)
R13  value 1K  [RESC_0805 (2012X50N)]  (hidden comment: RC0805FR-071KL)
R15  value 10K  [RESC_0805 (2012X50N)]  (hidden comment: RC0805FR-0710KL)
R16  value 10K  [RESC_0805 (2012X50N)]  (hidden comment: RC0805FR-0710KL)
R17  value 10K  [RESC_0805 (2012X50N)]  (hidden comment: RC0805FR-0710KL)
R18  value 10K  [RESC_0805 (2012X50N)]  (hidden comment: RC0805FR-0710KL)
R19  value 10K  [RESC_0805 (2012X50N)]  (hidden comment: RC0805FR-0710KL)
R20  value 10K  [RESC_0805 (2012X50N)]  (hidden comment: RC0805FR-0710KL)
R21  value 10K  [RESC_0805 (2012X50N)]  (hidden comment: RC0805FR-0710KL)
R22  value 10K  [RESC_0805 (2012X50N)]  (hidden comment: RC0805FR-0710KL)
R23  value 4.7K  [RESC_0805 (2012X50N)]  (hidden comment: CRCW08054K70FKEA)
R24  value 4.7K  [RESC_0805 (2012X50N)]  (hidden comment: CRCW08054K70FKEA)
R25  R?  [RESC_0805 (2012X50N)]  (value not drawn)
R26  R?  [RESC_0805 (2012X50N)]  (value not drawn)
R27  value 10K  [RESC_0805 (2012X50N)]  (hidden comment: RC0805FR-0710KL)
R28  value 1K  [RESC_0805 (2012X50N)]  (hidden comment: RC0805FR-071KL)
R30  value 1K  [RESC_0805 (2012X50N)]  (hidden comment: RC0805FR-071KL)
R31  value 10K  [RESC_0805 (2012X50N)]  (hidden comment: RC0805FR-0710KL)
R32  value 10K  [RESC_0805 (2012X50N)]  (hidden comment: RC0805FR-0710KL)
R33  value 10K  [RESC_0805 (2012X50N)]  (hidden comment: RC0805FR-0710KL)
R34  value 4.7K  [RESC_0805 (2012X50N)]  (hidden comment: CRCW08054K70FKEA)
R35  value 4.7K  [RESC_0805 (2012X50N)]  (hidden comment: CRCW08054K70FKEA)
R36  value 4.7K  [RESC_0805 (2012X50N)]  (hidden comment: CRCW08054K70FKEA)
R37  RC0805FR-070RL  [RESC_0805 (2012X50N)]  (value not drawn)
R38  R?  [RESC_0805 (2012X50N)]  (value not drawn)
R39  value 4.7K  [RESC_0805 (2012X50N)]  (hidden comment: CRCW08054K70FKEA)
R40  value 4.7K  [RESC_0805 (2012X50N)]  (hidden comment: CRCW08054K70FKEA)
R41  value 4.7K  [RESC_0805 (2012X50N)]  (hidden comment: CRCW08054K70FKEA)
R42  RC0805FR-070RL  [RESC_0805 (2012X50N)]  (value not drawn)
R43  RC0805FR-070RL  [RESC_0805 (2012X50N)]  (value not drawn)
R44  R?  [RESC_0805 (2012X50N)]  (value not drawn)
R45  RC0805FR-070RL  [RESC_0805 (2012X50N)]  (value not drawn)
R46  RC0805FR-070RL  [RESC_0805 (2012X50N)]  (value not drawn)
R47  RC0805FR-070RL  [RESC_0805 (2012X50N)]  (value not drawn)
R48  value 100R  [RESC_0805 (2012X50N)]  (hidden comment: WR08X1000FTL)
R49  value 100R  [RESC_0805 (2012X50N)]  (hidden comment: WR08X1000FTL)
R50  value 100R  [RESC_0805 (2012X50N)]  (hidden comment: WR08X1000FTL)
R51  value 100R  [RESC_0805 (2012X50N)]  (hidden comment: WR08X1000FTL)
R52  RC0805FR-070RL  [RESC_0805 (2012X50N)]  (value not drawn)
R53  RC0805FR-070RL  [RESC_0805 (2012X50N)]  (value not drawn)
R54  RC0805FR-070RL  [RESC_0805 (2012X50N)]  (value not drawn)
R55  value 0.01R  [RES_2512 (C6331X88N)]  (hidden comment: CSR2512A0R01F)
R56  value 10K  [RESC_0805 (2012X50N)]  (hidden comment: RC0805FR-0710KL)
R57  R?  [RESC_0805 (2012X50N)]  (value not drawn)
R58  R?  [RESC_0805 (2012X50N)]  (value not drawn)
R59  value 0.01R  [RES_2512 (C6331X88N)]  (hidden comment: CSR2512A0R01F)
R60  value 10K  [RESC_0805 (2012X50N)]  (hidden comment: RC0805FR-0710KL)
R61  value 0.01R  [RES_2512 (C6331X88N)]  (hidden comment: CSR2512A0R01F)
R62  value 10K  [RESC_0805 (2012X50N)]  (hidden comment: RC0805FR-0710KL)
R63  R?  [RESC_0805 (2012X50N)]  (value not drawn)
R64  R?  [RESC_0805 (2012X50N)]  (value not drawn)
R65  value 10K  [RESC_0805 (2012X50N)]  (hidden comment: RC0805FR-0710KL)
R66  R?  [RESC_0805 (2012X50N)]  (value not drawn)
R67  R?  [RESC_0805 (2012X50N)]  (value not drawn)
R68  R?  [RESC_0805 (2012X50N)]  (value not drawn)
R69  R?  [RESC_0805 (2012X50N)]  (value not drawn)
R70  R?  [RESC_0805 (2012X50N)]  (value not drawn)
R71#1  R?  [RESC_0805 (2012X50N)]  (value not drawn)
R71#2  R?  [RESC_0805 (2012X50N)]  (value not drawn)
R72  R?  [RESC_0805 (2012X50N)]  (value not drawn)
R73  value 10K  [RESC_0805 (2012X50N)]  (hidden comment: RC0805FR-0710KL)
R75  R?  [RESC_0805 (2012X50N)]  (value not drawn)
R76  R?  [RESC_0805 (2012X50N)]  (value not drawn)
R77  R?  [RESC_0805 (2012X50N)]  (value not drawn)
R78  R?  [RESC_0805 (2012X50N)]  (value not drawn)
R79  R?  [RESC_0805 (2012X50N)]  (value not drawn)
R80  R?  [RESC_0805 (2012X50N)]  (value not drawn)
R81  R?  [RESC_0805 (2012X50N)]  (value not drawn)
R82  R?  [RESC_0805 (2012X50N)]  (value not drawn)
R83  value 1K  [RESC_0805 (2012X50N)]  (hidden comment: RC0805FR-071KL)
R84  RC0805FR-070RL  [RESC_0805 (2012X50N)]  (value not drawn)
R85  R?  [RESC_0805 (2012X50N)]  (value not drawn)
R88  R?  [RESC_0805 (2012X50N)]  (value not drawn)
R95  value 1K  [RESC_0805 (2012X50N)]  (hidden comment: RC0805FR-071KL)
R96  value 10M  [RESC_0805 (2012X50N)]  (hidden comment: CRCW080510M0FKEA)
R97  value 51K  [RESC_0805 (2012X50N)]  (hidden comment: RC0805FR-0751KL)
R99  value 33K  [RESC_0805 (2012X50N)]  (hidden comment: RC0805FR-0733KL)
R100  value 22.1K  [RESC_0805 (2012X50N)]  (hidden comment: RC0805FR-0722K1L)
R102  R?  [RESC_0805 (2012X50N)]  (value not drawn)
R103  value 226K  [RESC_0805 (2012X50N)]  (hidden comment: RC0805FR-07226KL)
R104  value 64.9K  [RESC_0805 (2012X50N)]  (hidden comment: RC0805FR-0764K9L)
R105  value 64.9K  [RESC_0805 (2012X50N)]  (hidden comment: RC0805FR-0764K9L)
R106  value 10K  [RESC_0805 (2012X50N)]  (hidden comment: RC0805FR-0710KL)
R107  value 0R  [RESC_0805 (2012X50N)]  (hidden comment: RC0805FR-070RL)
R108  value 0R  [RESC_0805 (2012X50N)]  (hidden comment: RC0805FR-070RL)
R109  value 0R  [RESC_0805 (2012X50N)]  (hidden comment: RC0805FR-070RL)
R110  value 0R  [RESC_0805 (2012X50N)]  (hidden comment: RC0805FR-070RL)
R111  value 0R  [RESC_0805 (2012X50N)]  (hidden comment: RC0805FR-070RL)
R112  value 0R  [RESC_0805 (2012X50N)]  (hidden comment: RC0805FR-070RL)
R113  value 0R  [RESC_0805 (2012X50N)]  (hidden comment: RC0805FR-070RL)
R114  value 0R  [RESC_0805 (2012X50N)]  (hidden comment: RC0805FR-070RL)
R115  value 0R  [RESC_0805 (2012X50N)]  (hidden comment: RC0805FR-070RL)
R116  value 0R  [RESC_0805 (2012X50N)]  (hidden comment: RC0805FR-070RL)
R117  value 200R  [RESC_0805 (2012X50N)]  (hidden comment: RC0805FR-07200RL)
R118  value 0R  [RESC_0805 (2012X50N)]  (hidden comment: RC0805FR-070RL)
R119  value 0R  [RESC_0805 (2012X50N)]  (hidden comment: RC0805FR-070RL)
R120  value 301K  [RESC_0805 (2012X50N)]  (hidden comment: RT0805BRD07301KL)
R121  value 95.3K  [RESC_0805 (2012X50N)]  (hidden comment: RC0805FR-0795K3L)
R122  value 0R  [RESC_0805 (2012X50N)]  (hidden comment: RC0805FR-070RL)
R123  value 10K  [RESC_0805 (2012X50N)]  (hidden comment: RC0805FR-0710KL)
R124  value 0.004R  [RES_2512 (C6331X88N)]  (hidden comment: PA2512FKF7W0R004E)
R125  value 10K  [RESC_0805 (2012X50N)]  (hidden comment: RC0805FR-0710KL)
R126  value 10R  [RESC3115X65N]  (hidden comment: RC1206FR-0710RL)
R127  value 0R  [RESC_0805 (2012X50N)]  (hidden comment: RC0805FR-070RL)
R128  value 10K  [RESC_0805 (2012X50N)]  (hidden comment: RC0805FR-0710KL)
R129  value 33K  [RESC_0805 (2012X50N)]  (hidden comment: RC0805FR-0733KL)
R130  value 0.004R  [RES_2512 (C6331X88N)]  (hidden comment: PA2512FKF7W0R004E)
R131  value 10K  [RESC_0805 (2012X50N)]  (hidden comment: RC0805FR-0710KL)
R132  value 1K  [RESC_0805 (2012X50N)]  (hidden comment: RC0805FR-071KL)
R133  value 88.7K  [RESC_0805 (2012X50N)]  (hidden comment: RC0805FR-0788K7L)
R134  value 22.1K  [RESC_0805 (2012X50N)]  (hidden comment: RC0805FR-0722K1L)
R135  value 10K  [RESC_0805 (2012X50N)]  (hidden comment: RC0805FR-0710KL)
R136  value 1K  [RESC_0805 (2012X50N)]  (hidden comment: RC0805FR-071KL)
R137  value 33K  [RESC_0805 (2012X50N)]  (hidden comment: RC0805FR-0733KL)
R138  value 10R  [RESC3115X65N]  (hidden comment: RC1206FR-0710RL)
R139  value 100K  [RESC_0805 (2012X50N)]  (hidden comment: CRCW0805100KFKEA)
R141  value 100K  [RESC_0805 (2012X50N)]  (hidden comment: CRCW0805100KFKEA)
R142  value 100K  [RESC_0805 (2012X50N)]  (hidden comment: CRCW0805100KFKEA)
R143  R?  [RESC_0805 (2012X50N)]  (value not drawn)
R144  R?  [RESC_0805 (2012X50N)]  (value not drawn)
R145  value 0R  [RESC_0805 (2012X50N)]  (hidden comment: RC0805FR-070RL)
R146  value 10M  [RESC_0805 (2012X50N)]  (hidden comment: CRCW080510M0FKEA)
R147  value 0R  [RESC_0805 (2012X50N)]  (hidden comment: RC0805FR-070RL)
R148  R?  [RESC_0805 (2012X50N)]  (value not drawn)
R149  R?  [RESC_0805 (2012X50N)]  (value not drawn)
R150  R?  [RESC_0805 (2012X50N)]  (value not drawn)
R151  R?  [RESC_0805 (2012X50N)]  (value not drawn)
R152  R?  [RESC_0805 (2012X50N)]  (value not drawn)
R153  R?  [RESC_0805 (2012X50N)]  (value not drawn)
R154  R?  [RESC_0805 (2012X50N)]  (value not drawn)
R155  RC0805FR-070RL  [RESC_0805 (2012X50N)]  (value not drawn)
R156  RC0805FR-070RL  [RESC_0805 (2012X50N)]  (value not drawn)
R157  value 470R  [RESC_0805 (2012X50N)]  (hidden comment: CRCW0805470RFKEAC)
R158  value 470R  [RESC_0805 (2012X50N)]  (hidden comment: CRCW0805470RFKEAC)
R159  RC0805FR-070RL  [RESC_0805 (2012X50N)]  (value not drawn)
R160  RC0805FR-070RL  [RESC_0805 (2012X50N)]  (value not drawn)
R161  value 470R  [RESC_0805 (2012X50N)]  (hidden comment: CRCW0805470RFKEAC)
R162  value 470R  [RESC_0805 (2012X50N)]  (hidden comment: CRCW0805470RFKEAC)
R163  value 1K  [RESC_0805 (2012X50N)]  (hidden comment: RC0805FR-071KL)
R164  value 100R  [RESC_0805 (2012X50N)]  (hidden comment: WR08X1000FTL)
R165  value 1K  [RESC_0805 (2012X50N)]  (hidden comment: RC0805FR-071KL)
R166  value 100R  [RESC_0805 (2012X50N)]  (hidden comment: WR08X1000FTL)
R167  value 1K  [RESC_0805 (2012X50N)]  (hidden comment: RC0805FR-071KL)
R168  value 100R  [RESC_0805 (2012X50N)]  (hidden comment: WR08X1000FTL)
R169  value 1K  [RESC_0805 (2012X50N)]  (hidden comment: RC0805FR-071KL)
R170  value 100R  [RESC_0805 (2012X50N)]  (hidden comment: WR08X1000FTL)
R171  value 1K  [RESC_0805 (2012X50N)]  (hidden comment: RC0805FR-071KL)
R172  value 88.7K  [RESC_0805 (2012X50N)]  (hidden comment: RC0805FR-0788K7L)
R173  value 33K  [RESC_0805 (2012X50N)]  (hidden comment: RC0805FR-0733KL)
R174  value 88.7K  [RESC_0805 (2012X50N)]  (hidden comment: RC0805FR-0788K7L)
R175  value 43K  [RESC_0805 (2012X50N)]  (hidden comment: RC0805JR-0743KL)
R176  value 4.7K  [RESC_0805 (2012X50N)]  (hidden comment: CRCW08054K70FKEA)
R177  value 1K  [RESC_0805 (2012X50N)]  (hidden comment: RC0805FR-071KL)
R178  value 100K  [RESC_0805 (2012X50N)]  (hidden comment: CRCW0805100KFKEA)
R179  value 0R  [RESC_0805 (2012X50N)]  (hidden comment: RC0805FR-070RL)
R180  value 2.2M  [RESC_0805 (2012X50N)]  (hidden comment: ERJ-6ENF2204V)
R181  RC0805FR-070RL  [RESC_0805 (2012X50N)]  (value not drawn)
R182  RC0805FR-070RL  [RESC_0805 (2012X50N)]  (value not drawn)
R183  value 1K  [RESC_0805 (2012X50N)]  (hidden comment: RC0805FR-071KL)
R184  RC0805FR-070RL  [RESC_0805 (2012X50N)]  (value not drawn)
R185  value 1K  [RESC_0805 (2012X50N)]  (hidden comment: RC0805FR-071KL)
R186  value 1K  [RESC_0805 (2012X50N)]  (hidden comment: RC0805FR-071KL)
R187  RC0805FR-070RL  [RESC_0805 (2012X50N)]  (value not drawn)
R188  value 1K  [RESC_0805 (2012X50N)]  (hidden comment: RC0805FR-071KL)
R?  value 100K  [RESC_0805 (2012X50N)]  (hidden comment: CRCW0805100KFKEA)
RN1  value 47R  [RESCAV80P320X160X70-8N]  (hidden comment: TC164-JR-0747RL)
RN2  value 10K  [RESCAV80P320X160X70-8N]  (hidden comment: TC164-JR-0710KL)
RN3  value 47R  [RESCAV80P320X160X70-8N]  (hidden comment: TC164-JR-0747RL)
SJ1  SolderBridge  [JUMP POINT]  (value not drawn)
SJ2  SolderBridge  [JUMP POINT]  (value not drawn)
U2R1  E_PAD  [E_PAD (SMD)]  (value not drawn)
U2T1  E_PAD  [E_PAD (SMD)]  (value not drawn)
U3  TMP75AIDR  [SOIC127P600X175-8N]
U3R  E_PAD  [E_PAD (SMD)]  (value not drawn)
U3T  E_PAD  [E_PAD (SMD)]  (value not drawn)
U4  MK22FN1M0AVLQ12  [QFP50P2200X2200X160-144N]
U4R  E_PAD  [E_PAD (SMD)]  (value not drawn)
U4T  E_PAD  [E_PAD (SMD)]  (value not drawn)
U5  TMP75AIDR  [SOIC127P600X175-8N]
U7  ?  [SOIC127P600X175-8N]
U8  XB3-24Z8UM-J  [XCVR_XB3-24Z8UM-J]
U9  DRV8703QRHBTQ1  [QFN50P500X500X100-33N]
U10  DRV8703QRHBTQ1  [QFN50P500X500X100-33N]
U11  DRV8703QRHBTQ1  [QFN50P500X500X100-33N]
U12  JMTK50N06A  [TO-252AA(DPAK229P990X238-3N)]  (value not drawn)
U13  JMTK50N06A  [TO-252AA(DPAK229P990X238-3N)]  (value not drawn)
U14  JMTK50N06A  [TO-252AA(DPAK229P990X238-3N)]  (value not drawn)
U15  JMTK50N06A  [TO-252AA(DPAK229P990X238-3N)]  (value not drawn)
U16  JMTK50N06A  [TO-252AA(DPAK229P990X238-3N)]  (value not drawn)
U17  JMTK50N06A  [TO-252AA(DPAK229P990X238-3N)]  (value not drawn)
U18  JMTK50N06A  [TO-252AA(DPAK229P990X238-3N)]  (value not drawn)
U19  JMTK50N06A  [TO-252AA(DPAK229P990X238-3N)]  (value not drawn)
U20  JMTK50N06A  [TO-252AA(DPAK229P990X238-3N)]  (value not drawn)
U21  JMTK50N06A  [TO-252AA(DPAK229P990X238-3N)]  (value not drawn)
U22  JMTK50N06A  [TO-252AA(DPAK229P990X238-3N)]  (value not drawn)
U23  JMTK50N06A  [TO-252AA(DPAK229P990X238-3N)]  (value not drawn)
U27  TPS560430XFDBVT  [SOT23-6L]
U29  LTC4015EUHF#PBF  [QFN50P700X500X80-39N]
U33  TPS560430XFDBVT  [SOT23-6L]
U35  TL431ACDBZR  [SOT-23-3(TO-236)]  (value not drawn)
UART3_EXP  68001-108HLF  [HDR1X8 (male)]  (value not drawn)
UART4_EXP  68001-108HLF  [HDR1X8 (male)]  (value not drawn)
V_BRIDGE  E_PAD  [E_PAD (SMD)]  (value not drawn)
V_BUT  E_PAD  [E_PAD (SMD)]  (value not drawn)
Y1  ABM3B-8.000MHZ-B2-T  [OSC_ABM3B-8.000MHZ-B2-T]  (value not drawn)
Y2  value 32.768KHz  [2-SMD (3.2 X 1.5mm)]  (hidden comment: ABS07-32.768KHZ-T)

## Nets
+3V3: 3V3_IN.1 C7.2 C13.2 C14.2 C15.2 C16.2 C17.2 C18.2 C19.2 C23.2 C25.2 C27.2 C28.2 C29.2 C35.2 C40.2 C43.2 C86.2 C105.2 C108.2 C150.2 C155.2 D3.2 D4.2 D5.2 D6.2 D15.2 D16.2 D17.2 D18.2 D19.2 D20.2 D21.2 D22.2 D31.2 D33.2 D35.2 D37.2 J9.01 J28.4(VDD) JP1.1 JP2.1 JP4.1 L1.2 L4.1 L5.1 L12.1 L17.2 Q1.2 R5.2 R6.2 R7.2 R8.2 R9.2 R10.2 R11.2 R12.2 R16.2 R17.2 R18.2 R19.2 R20.2 R21.2 R22.2 R23.2 R24.2 R25.2 R26.1 R27.2 R31.2 R32.2 R33.2 R34.2 R35.2 R36.2 R37.1 R39.2 R40.2 R41.2 R42.1 R43.1 R65.2 R73.2 R84.2 R97.2 R128.2 RN2.5 RN2.6 RN2.7 RN2.8 U3.8(V+) U4.5(VDD) U4.16(VDD) U4.43(VDD) U4.56(VDD) U4.70(VDD) U4.94(VDD) U4.108(VDD) U4.122(VDD) U4.135(VDD) U5.8(V+) U7.8(V+) U29.3(DVCC)
+5V: 5V_IN.1 BUZ.1 C33.2 C61.2 C63.2 C101.2 C113.2 ENC_1.1 ENC_2.1 IC1.5(VCC+) L6.1 L7.1 L13.1 P2.1 R13.2 R133.2 R138.2 R188.2
+24V: C37.2 C121.2 C122.1 C124.1 C127.1 C128.2 C130.2 C131.2 C132.2 C133.2 C134.2 C135.2 C137.1(+) C146.2 C147.2 C148.2 C149.2 F1.1 F1.2 IC7.5 IC7.6 IC7.7 IC7.8 L2.1 L3.1 P1.1 Q9.1(S) Q9.2(S) Q9.3(S) R124.2 R127.2 R137.2 R139.2 R141.2 U27.5(VIN) U29.31(SYS) U33.5(VIN)
+24V_K1: C38.2 C39.2 C41.2 C42.2 C44.1 C45.1 C46.1 D39.1 D39.3 K1.4(NO) R126.1 R129.2 R145.2 U9.27(VDRAIN) U9.28(VM) U10.27(VDRAIN) U10.28(VM) U11.27(VDRAIN) U11.28(VM)
GND: 3V3_IN.2 C3.1 C4.1 C5.1 C6.1 C7.1 C8.1 C9.1 C10.2(-) C11.1 C12.1 C13.1 C14.1 C15.1 C16.1 C17.1 C18.1 C19.1 C20.1 C21.1 C22.1 C23.1 C24.1 C25.1 C27.1 C28.1 C29.1 C30.1 C33.1 C34.2 C35.1 C37.1 C38.1 C39.1 C40.1 C41.1 C42.1 C43.1 C47.1 C51.1 C52.1 C53.1 C54.1 C55.1 C56.1 C57.1 C58.1 C59.1 C60.2(-) C61.1 C62.2(-) C63.1 C64.2(-) C65.2(-) C66.2(-) C67.2(-) C68.1 C69.1 C70.1 C71.1 C72.1 C73.1 C74.1 C75.1 C76.1 C77.1 C86.1 C101.1 C105.1 C106.1 C107.2 C108.1 C109.1 C110.1 C111.1 C113.1 C120.1 C123.1 C124.2 C125.2 C126.1 C127.2 C128.1 C129.1 C130.1 C131.1 C132.1 C133.1 C134.1 C135.1 C137.2(-) C138.1 C139.1 C140.1 C141.1 C142.1 C143.1 C144.1 C146.1 C147.1 C148.1 C149.1 C150.1 C153.1 C155.1 D2.2 D3.1 D4.1 D5.1 D6.1 D7.3 D8.3 D9.A D10.A D11.A D12.A D13.A D14.A D15.1 D16.1 D17.1 D18.1 D19.1 D20.1 D21.1 D22.1 D23.3 D24.3 D25.3 D26.3 D31.1 D33.1 D35.1 D37.1 D40.2(A) DBG_UART.3 ENC_1.4 ENC_2.4 IC1.2(GND) IC3.1 IC3.2 IC3.3 IC4.1 IC4.2 IC4.3 IC6.5 IC6.6 IC6.7 IC6.8 IC8.1 IC8.2 IC8.3 IC9.5 IC9.6 IC9.7 IC9.8 J9.03 J9.05 J9.09 J28.6(VSS) J28.P1(SHIELD) J28.P2(SHIELD) J28.P3(SHIELD) J28.P4(SHIELD) J28.SWB(B) JP1.6 JP2.5 JP3.1 JP4.4 JP5.1 JP6.1 JP7.1 L19.1 LED5.1(K2) LED7.1(K2) LED8.1(K2) LED9.1(K2) LED10.1(K2) LED13.1(K2) LED14.1(K2) LED15.1(K2) P1.2 P2.2 Q2.2(E) Q3.2(E) Q4.2(E) Q5.2(E) Q6.2(E) Q7.2(E) Q8.2(E) Q10.2(E) Q13.2(C) Q15.2(C) Q16.2(C) Q17.2(C) R4.2 R15.1 R38.2 R45.2 R46.2 R47.2 R52.2 R53.2 R54.2 R55.1 R59.1 R61.1 R63.1 R64.1 R81.1 R82.1 R85.1 R88.1 R100.1 R102.1 R105.1 R108.1 R110.2 R112.2 R114.2 R116.2 R117.1 R119.2 R121.1 R125.1 R131.2 R134.1 R135.1 R142.1 R143.1 R144.1 R148.1 R149.1 R150.1 R151.1 R152.1 R153.1 R154.1 R155.2 R156.2 R157.1 R158.1 R159.2 R160.2 R161.1 R162.1 R174.1 R176.1 R178.1 R179.2 R?.1 U3.4(GND) U3.5(A2) U3.6(A1) U3.7(A0) U4.6(VSS) U4.17(VSS) U4.18(VSS) U4.33(VREFL) U4.34(VSSA) U4.44(VSS) U4.57(VSS) U4.71(VSS) U4.93(VSS) U4.107(VSS) U4.121(VSS) U4.134(VSS) U5.4(GND) U5.5(A2) U5.6(A1) U7.4(GND) U8.1(GND) U8.10(GND) U8.12(GND) U8.21(GND) U8.32(GND) U8.34(GND) U9.1(GND) U9.13(GND) U9.17(GND) U9.22(SN) U9.33(EXP) U10.1(GND) U10.13(GND) U10.17(GND) U10.22(SN) U10.33(EXP) U11.1(GND) U11.13(GND) U11.17(GND) U11.22(SN) U11.33(EXP) U27.2(GND) U29.7(SGND) U29.13(EQ) U29.14(GND) U29.39(EXP) U33.2(GND) U35.3(ANODE) UART3_EXP.8 UART4_EXP.8 Y1.2(GND) Y1.4(GND)
K1_1: D36.2(A) K1.1(-_1) Q10.3(C)
K1_2: D38.2(A) K1.2(-_2) Q8.3(C)
K1_5: C138.2 D36.1(C) D38.1(C) K1.5(+) R138.1
PWR1+: D9.K J16.1(P1) J16.2(P1) U9.19(SH1) U14.4(D) U15.3(S)
PWR1-: D12.K J15.1(P1) J15.2(P1) U9.25(SH2) U12.3(S) U13.4(D)
PWR2+: D10.K J18.1(P1) J18.2(P1) U10.19(SH1) U18.4(D) U19.3(S)
PWR2-: D13.K J17.1(P1) J17.2(P1) U10.25(SH2) U16.3(S) U17.4(D)
PWR3+: U11.19(SH1)
PWR3-: U11.25(SH2)
S1_GND: R55.2 U9.21(SP) U9.23(SL2) U13.3(S) U14.3(S)
S2_GND: R59.2 U10.21(SP) U10.23(SL2) U17.3(S) U18.3(S)
S3_GND: U11.21(SP) U11.23(SL2)
V_BRIDGE: C60.1(+) C62.1(+) C64.1(+) C65.1(+) C66.1(+) C67.1(+) C139.2 C140.2 C141.2 C142.2 C143.2 C144.2 D39.4 J27.1(P1) J27.2(P1) Q14.2(E) U12.4(D) U15.4(D) U16.4(D) U19.4(D) U20.4(D) U23.4(D) V_BRIDGE.1
V_BUT: U29.18(BATSENS) V_BUT.1
VCC: C123.2 C125.1 D30.2(A) R107.1 R109.1 R111.1 R113.1 R115.1 R118.1 U29.27(DRVCC) U29.28(INTVCC)
VIN: C106.2 C109.2 C110.2 F2.3 F2.4 IC5.1 IC5.2 IC5.3 R99.2 R103.2 U29.35(VIN)
VIN_DC: D34.4 F2.1 F2.2 J24.1(P1) J24.2(P1) R146.2 R175.2
A0: R7.1 U5.7(A0) ; off-sheet A0
BUZ: Q6.1(B) U4.84(PTB3) ; off-sheet BUZ
CELLS0: R113.2 R114.1 U29.38(CELLS0) ; off-sheet CELLS0
CELLS1: R115.2 R116.1 U29.1(CELLS1) ; off-sheet CELLS1
CELLS2: R118.2 R119.1 U29.2(CELLS2) ; off-sheet CELLS2
CHEM0: R109.2 R110.1 U29.36(CHEM0) ; off-sheet CHEM0
CHEM1: R111.2 R112.1 U29.37(CHEM1) ; off-sheet CHEM1
CLK: J9.04 JP2.3 R15.2 U4.50(PTA0) ; off-sheet CLK
CLN: C115.2 C121.1 R127.1 U29.32(CLN) ; off-sheet CLN
CLP: C115.1 R122.1 U29.33(CLP) ; off-sheet CLP
CS1: RN2.3 U4.104(PTC1/LLWU_P6) U9.5(NSCS) ; off-sheet CS1
CS2: RN2.2 U4.105(PTC2) U10.5(NSCS) ; off-sheet CS2
CS3: RN2.1 U4.106(PTC3/LLWU_P7) U11.5(NSCS) ; off-sheet CS3
CSN: C118.2 C126.2 C129.2 J8.1(P1) J8.2(P1) R96.2 R130.2 U29.19(CSN) ; off-sheet CSN
CSP: C117.1 C118.1 L10.1 Q9.5(D) Q9.6(D) Q9.7(D) Q9.8(D) Q9.9(D) R130.1 U29.20(CSP) ; off-sheet CSP
CTS: RN1.4 U8.24(~{CTS!/DIO7}) ; off-sheet CTS
DATAIN: J28.3(CMD) RN3.3 ; off-sheet DATAIN
DATAOUT: J28.7(DAT0) RN3.1 ; off-sheet DATAOUT
DIO: J9.02 JP2.2 R16.1 U4.53(PTA3) ; off-sheet DIO
ENC11: C56.2 R48.1 U4.60(PTA8) ; off-sheet ENC11
ENC12: C57.2 R49.1 U4.61(PTA9) ; off-sheet ENC12
ENC21: C58.2 R50.1 U4.62(PTA10) ; off-sheet ENC21
ENC22: C59.2 R51.1 U4.63(PTA11) ; off-sheet ENC22
EXP0: C70.2 R58.2 U4.126(PTC19) ; off-sheet EXP0
EXP1: C71.2 R66.2 U4.125(PTC18) ; off-sheet EXP1
EXP2: C72.2 R67.2 U4.75(PTA24) ; off-sheet EXP2
EXP3: C73.2 R68.2 U4.76(PTA25) ; off-sheet EXP3
EXP4: C74.2 R69.2 U4.77(PTA26) ; off-sheet EXP4
EXP5: C75.2 R70.2 U4.78(PTA27) ; off-sheet EXP5
EXP6: C76.2 R71#2.2 U4.79(PTA28) ; off-sheet EXP6
EXP7: C77.2 R72.2 U4.80(PTA29) ; off-sheet EXP7
GH11: U9.18(GH1) U15.1(G) ; off-sheet GH11
GH12: U9.26(GH2) U12.1(G) ; off-sheet GH12
GH21: U10.18(GH1) U19.1(G) ; off-sheet GH21
GH22: U10.26(GH2) U16.1(G) ; off-sheet GH22
GH31: U11.18(GH1) U23.1(G) ; off-sheet GH31
GH32: U11.26(GH2) U20.1(G) ; off-sheet GH32
GL11: U9.20(GL1) U14.1(G) ; off-sheet GL11
GL12: U9.24(GL2) U13.1(G) ; off-sheet GL12
GL21: U10.20(GL1) U18.1(G) ; off-sheet GL21
GL22: U10.24(GL2) U17.1(G) ; off-sheet GL22
GL31: U11.20(GL1) U22.1(G) ; off-sheet GL31
GL32: U11.24(GL2) U21.1(G) ; off-sheet GL32
GP1: U4.67(PTA15) U8.31(AD0/DIO0) ; off-sheet GP1
GP2: U4.68(PTA16) U8.30(AD1/DIO1) ; off-sheet GP2
GPIO0: D23.1 GPIO_EXP.1 R57.1 R64.2 ; off-sheet GPIO0
GPIO1: D23.2 GPIO_EXP.2 R71#1.1 R148.2 ; off-sheet GPIO1
GPIO2: D24.1 GPIO_EXP.3 R75.1 R154.2 ; off-sheet GPIO2
GPIO3: D24.2 GPIO_EXP.4 R76.1 R153.2 ; off-sheet GPIO3
GPIO4: D25.1 GPIO_EXP.5 R77.1 R152.2 ; off-sheet GPIO4
GPIO5: D25.2 GPIO_EXP.6 R78.1 R151.2 ; off-sheet GPIO5
GPIO6: D26.1 GPIO_EXP.7 R79.1 R150.2 ; off-sheet GPIO6
GPIO7: D26.2 GPIO_EXP.8 R80.1 R149.2 ; off-sheet GPIO7
INFET: IC5.4 U29.34(INFET) ; off-sheet INFET
JP1_CTS: JP1.4 L19.2 R167.2 ; off-sheet JP1_CTS
JP1_RTS: JP1.5 R169.2 ; off-sheet JP1_RTS
JP1_RX: JP1.3 R165.2 ; off-sheet JP1_RX
JP1_TX: JP1.2 R163.2 ; off-sheet JP1_TX
K1_RESET: R135.2 R136.2 U4.92(PTB11) ; off-sheet K1_RESET
K1_SET: R131.1 R132.2 U4.91(PTB10) ; off-sheet K1_SET
LED1: Q2.1(B) U4.95(PTB16) ; off-sheet LED1
LED2: Q3.1(B) U4.96(PTB17) ; off-sheet LED2
LED3: Q4.1(B) U4.99(PTB20) ; off-sheet LED3
LED4: Q5.1(B) U4.100(PTB21) ; off-sheet LED4
LED13: R28.2 U8.7(RSSI_PWM/DIO10) ; off-sheet LED13
LED14: R30.2 U8.9(~{DTR!/SLEEP_RQ/DIO8}) ; off-sheet LED14
LED15: R83.2 U8.26(ASSOCIATE/DIO5) ; off-sheet LED15
M_RX1: RN1.2 SJ2.3 U2R1.1 ; off-sheet M_RX1
M_TX1: RN1.1 SJ1.3 U2T1.1 ; off-sheet M_TX1
MISO: R39.1 R40.1 R41.1 R73.1 RN3.5 U4.112(PTC7) U7.2(SCL) U9.4(SDO) U10.4(SDO) U11.4(SDO) ; off-sheet MISO
MODE1: R42.2 R46.1 U9.11(MODE) ; off-sheet MODE1
MODE2: R43.2 R47.1 U10.11(MODE) ; off-sheet MODE2
MODE3: R37.2 R45.1 U11.11(MODE) ; off-sheet MODE3
MOSI: RN3.7 U4.111(PTC6/LLWU_P10) U7.5(A2) U9.6(SDI) U10.6(SDI) U11.6(SDI) ; off-sheet MOSI
MPPT: R107.2 R108.2 U29.21(MPPT) ; off-sheet MPPT
NFAULT1: R17.1 U4.87(PTB6) U9.10(NFAULT) ; off-sheet NFAULT1
NFAULT2: R19.1 U4.86(PTB5) U10.10(NFAULT) ; off-sheet NFAULT2
NFAULT3: R21.1 U4.85(PTB4) U11.10(NFAULT) ; off-sheet NFAULT3
NTC: J22.1(P1) J22.2(P1) R123.1 R125.2 U29.11(NTC) ; off-sheet NTC
NWDFLT1: R22.1 U4.90(PTB9) U9.9(NWDFLT) ; off-sheet NWDFLT1
NWDFLT2: R20.1 U4.89(PTB8) U10.9(NWDFLT) ; off-sheet NWDFLT2
NWDFLT3: R18.1 U4.88(PTB7) U11.9(NWDFLT) ; off-sheet NWDFLT3
PW11: PW11.1 U4.14(PTE11) U9.2(IN1/PH) ; off-sheet PW11
PW12: PW12.1 U4.15(PTE12) U9.3(IN2/EN) ; off-sheet PW12
PW21: PW21.1 U4.136(PTD7) U10.2(IN1/PH) ; off-sheet PW21
PW22: PW22.1 U4.133(PTD6/LLWU_P15) U10.3(IN2/EN) ; off-sheet PW22
PW31: PW31.1 U4.97(PTB18) U11.2(IN1/PH) ; off-sheet PW31
PW32: PW32.1 U4.98(PTB19) U11.3(IN2/EN) ; off-sheet PW32
RST: C30.2 J9.10 JP2.4 R27.1 U4.74(~{RESET_B}) ; off-sheet RST
RTS: RN1.3 U8.27(~{RTS!/DIO6}) ; off-sheet RTS
RX1: JP4.3 SJ2.1 ; off-sheet RX1
SCL: R35.1 U4.115(PTC10) U29.4(SCL) ; off-sheet SCL
SCLK: RN3.6 U4.110(PTC5/LLWU_P9) U7.6(A1) U9.7(SCLK) U10.7(SCLK) U11.7(SCLK) ; off-sheet SCLK
SD_CLK: J28.5(CLK) RN3.2 ; off-sheet SD_CLK
SD_CS: RN3.8 U4.109(PTC4/LLWU_P8) ; off-sheet SD_CS
SD_SWA: J28.SWA(A) R65.1 U4.83(PTB2) ; off-sheet SD_SWA
SDA: R34.1 U4.116(PTC11/LLWU_P11) U29.5(SDA) ; off-sheet SDA
SEL: J28.2(CD/DAT3) R128.1 RN3.4 ; off-sheet SEL
SLEEP1: R31.1 U4.144(PTD15) U9.8(NSLEEP) ; off-sheet SLEEP1
SLEEP2: R32.1 U4.143(PTD14) U10.8(NSLEEP) ; off-sheet SLEEP2
SLEEP3: R33.1 U4.142(PTD13) U11.8(NSLEEP) ; off-sheet SLEEP3
SMBALERT: R36.1 U4.114(PTC9) U29.6(~{SMBALERT}) ; off-sheet SMBALERT
SO1: C4.2 U4.28(ADC0_DM0/ADC1_DM3) U9.16(SO) ; off-sheet SO1
SO2: C5.2 U4.29(ADC1_DP0/ADC0_DP3) U10.16(SO) ; off-sheet SO2
SO3: C6.2 U4.30(ADC1_DM0/ADC0_DM3) U11.16(SO) ; off-sheet SO3
TMP_SCL: R24.1 U3.2(SCL) U4.81(PTB0/LLWU_P5) U5.2(SCL) ; off-sheet TMP_SCL
TMP_SDA: R23.1 U3.1(SDA) U4.82(PTB1) U5.1(SDA) ; off-sheet TMP_SDA
TX1: JP4.2 SJ1.1 ; off-sheet TX1
U3_ALERT: R12.1 U3.3(ALERT) U4.45(PTE24) ; off-sheet U3_ALERT
U4_CTS: RN1.8 U4.127(PTD0/LLWU_P12) ; off-sheet U4_CTS
U4_RTS: RN1.7 U4.128(PTD1) ; off-sheet U4_RTS
U4_RX1: RN1.6 U4.129(PTD2/LLWU_P13) ; off-sheet U4_RX1
U4_TX1: RN1.5 U4.130(PTD3) ; off-sheet U4_TX1
U5_ALERT: R11.1 U4.46(PTE25) U5.3(ALERT) ; off-sheet U5_ALERT
U7_CS: RN2.4 U4.103(PTC0) U7.1(SDA) ; off-sheet U7_CS
U8_RST: U4.69(PTA17) U8.6(~{RESET}) ; off-sheet U8_RST
U9_AVDD: C47.2 R56.1 U9.14(AVDD) ; off-sheet U9_AVDD
U9_VREF: R52.1 R56.2 U9.15(VREF) ; off-sheet U9_VREF
U10_AVDD: C51.2 R60.1 U10.14(AVDD) ; off-sheet U10_AVDD
U10_VREF: R53.1 R60.2 U10.15(VREF) ; off-sheet U10_VREF
U11_AVDD: C52.2 R62.1 U11.14(AVDD) ; off-sheet U11_AVDD
U11_VREF: R54.1 R62.2 U11.15(VREF) ; off-sheet U11_VREF
UART1_RX: DBG_UART.2 U4.2(PTE1/LLWU_P0) ; off-sheet UART1_RX
UART1_TX: DBG_UART.1 U4.1(PTE0) ; off-sheet UART1_TX
UART3_CTS: U4.9(PTE6) UART3_EXP.4 ; off-sheet UART3_CTS
UART3_RTS: U4.10(PTE7) UART3_EXP.5 ; off-sheet UART3_RTS
UART3_RX: U3R.1 U4.8(PTE5) UART3_EXP.3 ; off-sheet UART3_RX
UART3_RX1: U4.123(PTC16) UART4_EXP.7 ; off-sheet UART3_RX1
UART3_TX: U3T.1 U4.7(PTE4/LLWU_P2) UART3_EXP.2 ; off-sheet UART3_TX
UART3_TX1: U4.124(PTC17) UART4_EXP.6 ; off-sheet UART3_TX1
UART4_CTS: U4.118(PTC13) UART4_EXP.4 ; off-sheet UART4_CTS
UART4_RTS: U4.117(PTC12) UART4_EXP.5 ; off-sheet UART4_RTS
UART4_RX: U4.119(PTC14) U4R.1 UART4_EXP.3 ; off-sheet UART4_RX
UART4_TX: U4.120(PTC15) U4T.1 UART4_EXP.2 ; off-sheet UART4_TX
UART5_CTS1: R168.1 U4.140(PTD11) ; off-sheet UART5_CTS1
UART5_RTS1: R170.1 U4.139(PTD10) ; off-sheet UART5_RTS1
UART5_RX: U4.12(PTE9) UART3_EXP.7 ; off-sheet UART5_RX
UART5_RX1: R166.1 U4.137(PTD8) ; off-sheet UART5_RX1
UART5_TX: U4.11(PTE8) UART3_EXP.6 ; off-sheet UART5_TX
UART5_TX1: R164.1 U4.138(PTD9) ; off-sheet UART5_TX1
USB_DM: U4.20(USB0_DM) ; off-sheet USB_DM
USB_DP: U4.19(USB0_DP) ; off-sheet USB_DP
VBAT: C10.1(+) D2.3 U4.42(VBAT) ; off-sheet VBAT
VDDA: C8.2 C9.2 D2.1 L1.1 U4.31(VDDA) ; off-sheet VDDA
Net5V_IN_2: 5V_IN.2 Q7.3(C)
NetBUZ_2: BUZ.2 Q6.3(C)
NetC3_2: C3.2 Q1.1 R4.1 U4.26(ADC1_DM1)
NetC11_2: C11.2 U4.32(VREFH) U4.37(VREF_OUT/CMP1_IN5/CMP0_IN5/ADC1_SE18)
NetC12_2: C12.2 U4.21(VOUT33) U4.22(VREGIN)
NetC20_2: C20.2 U4.72(PTA18) Y1.1
NetC21_2: C21.2 U4.40(XTAL32) Y2.2
NetC22_2: C22.2 U4.41(EXTAL32) Y2.1
NetC24_2: C24.2 U4.73(PTA19) Y1.3
NetC34_1: C34.1 L17.1 U8.2(VCC)
NetC44_2: C44.2 U9.29(VCP)
NetC45_2: C45.2 U10.29(VCP)
NetC46_2: C46.2 U11.29(VCP)
NetC48_1: C48.1 U9.30(CPH)
NetC48_2: C48.2 U9.31(CPL)
NetC49_1: C49.1 U10.30(CPH)
NetC49_2: C49.2 U10.31(CPL)
NetC50_1: C50.1 U11.30(CPH)
NetC50_2: C50.2 U11.31(CPL)
NetC53_2: C53.2 U9.12(DVDD)
NetC54_2: C54.2 U10.12(DVDD)
NetC55_2: C55.2 U11.12(DVDD)
NetC68_2: C68.2 L2.2 L4.2 L6.2 UART3_EXP.1
NetC69_2: C69.2 L3.2 L5.2 L7.2 UART4_EXP.1
NetC104_1: C104.1 D29.1(C) IC9.4 R96.1
NetC104_2: C104.2 D29.2(A) IC9.1 IC9.2 IC9.3 J14.1(P1) J14.2(P1)
NetC107_1: C107.1 R106.1 U29.8(UVCLFB)
NetC111_2: C111.2 C112.2 U29.9(VC)
NetC112_1: C112.1 R117.2
NetC114_1: C114.1 R120.1 U29.17(CCREFP)
NetC114_2: C114.2 R120.2
NetC116_1: C116.1 D30.1(C) U29.25(BOOST)
NetC116_2: C116.2 U29.23(SW)
NetC117_2: C117.2 U29.15(CSPM5)
NetC119_1: C119.1 F1.3 F1.4 K1.3(COM)
NetC119_2: C119.2 R126.2
NetC120_2: C120.2 U29.22(2P5VCC)
NetC122_2: C122.2 U29.30(SYSM5)
NetC136_1: C136.1 L13.2 U33.6(SW)
NetC136_2: C136.2 U33.1(CB)
NetC145_1: C145.1 L12.2 U27.6(SW)
NetC145_2: C145.2 U27.1(CB)
NetC153_2: C153.2 R171.2 R175.1 R176.2
NetC154_1: C154.1 D27.1(C) IC6.4 R146.1 R180.1
NetC154_2: C154.2 D27.2(A) D28.A D32.A IC6.1 IC6.2 IC6.3 J10.1(P1) J10.2(P1) J11.1(P1) J11.2(P1) R180.2
NetD3_3: D3.3 Q13.1(E) R48.2 R95.2 R159.1
NetD4_3: D4.3 Q17.1(E) R49.2 R160.1 R183.2
NetD5_3: D5.3 Q15.1(E) R50.2 R156.1 R185.2
NetD6_3: D6.3 Q16.1(E) R51.2 R155.1 R186.2
NetD7_1: D7.1 ENC_1.2 R95.1 R162.2 R181.1
NetD7_2: D7.2 ENC_1.3 R161.2 R182.1 R183.1
NetD8_1: D8.1 ENC_2.2 R157.2 R184.1 R185.1
NetD8_2: D8.2 ENC_2.3 R158.2 R186.1 R187.1
NetD11_K: D11.K J20.1(P1) J20.2(P1) U22.4(D) U23.3(S)
NetD14_K: D14.K J19.1(P1) J19.2(P1) U20.3(S) U21.4(D)
NetD15_3: D15.3 R57.2 R58.1 R63.2
NetD16_3: D16.3 R66.1 R71#1.2 R144.2
NetD17_3: D17.3 R67.1 R75.2 R143.2
NetD18_3: D18.3 R68.1 R76.2 R102.2
NetD19_3: D19.3 R69.1 R77.2 R88.2
NetD20_3: D20.3 R70.1 R78.2 R85.2
NetD21_3: D21.3 R71#2.1 R79.2 R82.2
NetD22_3: D22.3 R72.1 R80.2 R81.2
NetD28_K: D28.K J2.2(P1)
NetD31_3: D31.3 R163.1 R164.2
NetD32_K: D32.K J12.2(P1)
NetD33_3: D33.3 R165.1 R166.2
NetD34_1: D34.1 J2.1(P1)
NetD34_3: D34.3 J12.1(P1)
NetD35_3: D35.3 R167.1 R168.2
NetD37_3: D37.3 R169.1 R170.2
NetD40_1: D40.1(C) IC4.4 R147.2 R179.1
NetIC1_1: IC1.1(1IN+) R171.1 R172.2
NetIC1_3: IC1.3(1IN-) R173.2 R188.1 U35.1(CATHODE)
NetIC1_4: IC1.4(OUT) R172.1 R177.2
NetIC3_4: IC3.4 R177.1 R178.2
NetIC3_5: IC3.5 IC3.6 IC3.7 IC3.8 J23.1(P1) J23.2(P1)
NetIC4_5: IC4.5 IC4.6 IC4.7 IC4.8 J26.1(P1) J26.2(P1)
NetIC5_5: IC5.5 IC5.6 IC5.7 IC5.8 R122.2 R124.1
NetIC7_1: IC7.1 IC7.2 IC7.3 IC8.5 IC8.6 IC8.7 IC8.8 L10.2
NetIC7_4: IC7.4 U29.24(TG)
NetIC8_4: IC8.4 U29.26(BG)
NetLED1_1: LED1.1(K2) Q2.3(C)
NetLED1_2: LED1.2(A2) R5.1
NetLED2_1: LED2.1(K2) Q3.3(C)
NetLED2_2: LED2.2(A2) R6.1
NetLED3_1: LED3.1(K2) Q4.3(C)
NetLED3_2: LED3.2(A2) R8.1
NetLED4_1: LED4.1(K2) Q5.3(C)
NetLED4_2: LED4.2(A2) R10.1
NetLED5_2: LED5.2(A2) R99.1
NetLED7_2: LED7.2(A2) R129.1
NetLED8_2: LED8.2(A2) R137.1
NetLED9_2: LED9.2(A2) R13.1
NetLED10_2: LED10.2(A2) R9.1
NetLED13_2: LED13.2(A2) R28.1
NetLED14_2: LED14.2(A2) R30.1
NetLED15_2: LED15.2(A2) R83.1
NetQ7_1: Q7.1(B) R44.1
NetQ8_1: Q8.1(B) R136.1
NetQ9_4: Q9.4(G) U29.29(OUTFET)
NetQ10_1: Q10.1(B) R132.1
NetQ13_3: Q13.3(B) R181.2
NetQ14_1: Q14.1(B) R145.1
NetQ14_3: Q14.3(C) R147.1
NetQ15_3: Q15.3(B) R184.2
NetQ16_3: Q16.3(B) R187.2
NetQ17_3: Q17.3(B) R182.2
NetR25_1: R25.1 U7.7(A0)
NetR26_2: R26.2 U7.3(ALERT)
NetR38_1: R38.1 R44.2 U4.59(PTA7)
NetR61_2: R61.2 U21.3(S) U22.3(S)
NetR84_1: R84.1 U8.11(SPI_!ATTN!/!BOOTMODE!/DIO19)
NetR97_1: R97.1 R100.2 U27.3(FB)
NetR103_1: R103.1 R104.2
NetR104_1: R104.1 R105.2 R106.2
NetR121_2: R121.2 U29.10(RT)
NetR123_2: R123.2 U29.12(NTCBIAS)
NetR133_1: R133.1 R134.2 U33.3(FB)
NetR139_1: R139.1 R?.2 U33.4(EN)
NetR141_1: R141.1 R142.2 U27.4(EN)
NetR173_1: R173.1 R174.2 U35.2(REF)
NetSJ1_2: SJ1.2 U8.4(DIN/!CONFIG!/DIO14)
NetSJ2_2: SJ2.2 U8.3(DOUT/DIO13)

Not connected (* = marked no-connect by the designer): J9 06* 07* 08*; J28 1(DAT2) 8(DAT1); U4 3(PTE2/LLWU_P1)* 4(PTE3)* 13(PTE10)* 23(ADC0_DP1)* 24(ADC0_DM1)* 25(ADC1_DP1)* 27(ADC0_DP0/ADC1_DP3)* 35(ADC1_SE16/CMP2_IN2/ADC0_SE22)* 36(ADC0_SE16/CMP1_IN2/ADC0_SE21)* 38(DAC0_OUT/CMP1_IN3/ADC0_SE23)* 39(DAC1_OUT/CMP0_IN4/CMP2_IN3/ADC1_SE23)* 47(PTE26)* 48(PTE27)* 49(PTE28)* 51(PTA1)* 52(PTA2)* 54(PTA4/LLWU_P3)* 55(PTA5)* 58(PTA6)* 64(PTA12)* 65(PTA13/LLWU_P4)* 66(PTA14)* 101(PTB22)* 102(PTB23)* 113(PTC8)* 131(PTD4/LLWU_P14)* 132(PTD5)* 141(PTD12)*; U8 5(DIO12)* 8(PWM1/DIO11)* 13(SPI_CLK/DIO18)* 14(SPI_!SSEL!/DIO17)* 15(SPI_MOSI/DIO16)* 16(SPI_MISO/DIO15)* 23(DIO4)* 25(ON/!SLEEP!/DIO9)* 28(AD3/DIO3)* 29(AD2/DIO2)* 33(RF)*; U9 32(NC)*; U10 32(NC)*; U11 32(NC)*; U29 16(CCREFM)